# EAGLE design msc3102 (EAGLE 6.6.0)

## Sheet 1 of 3
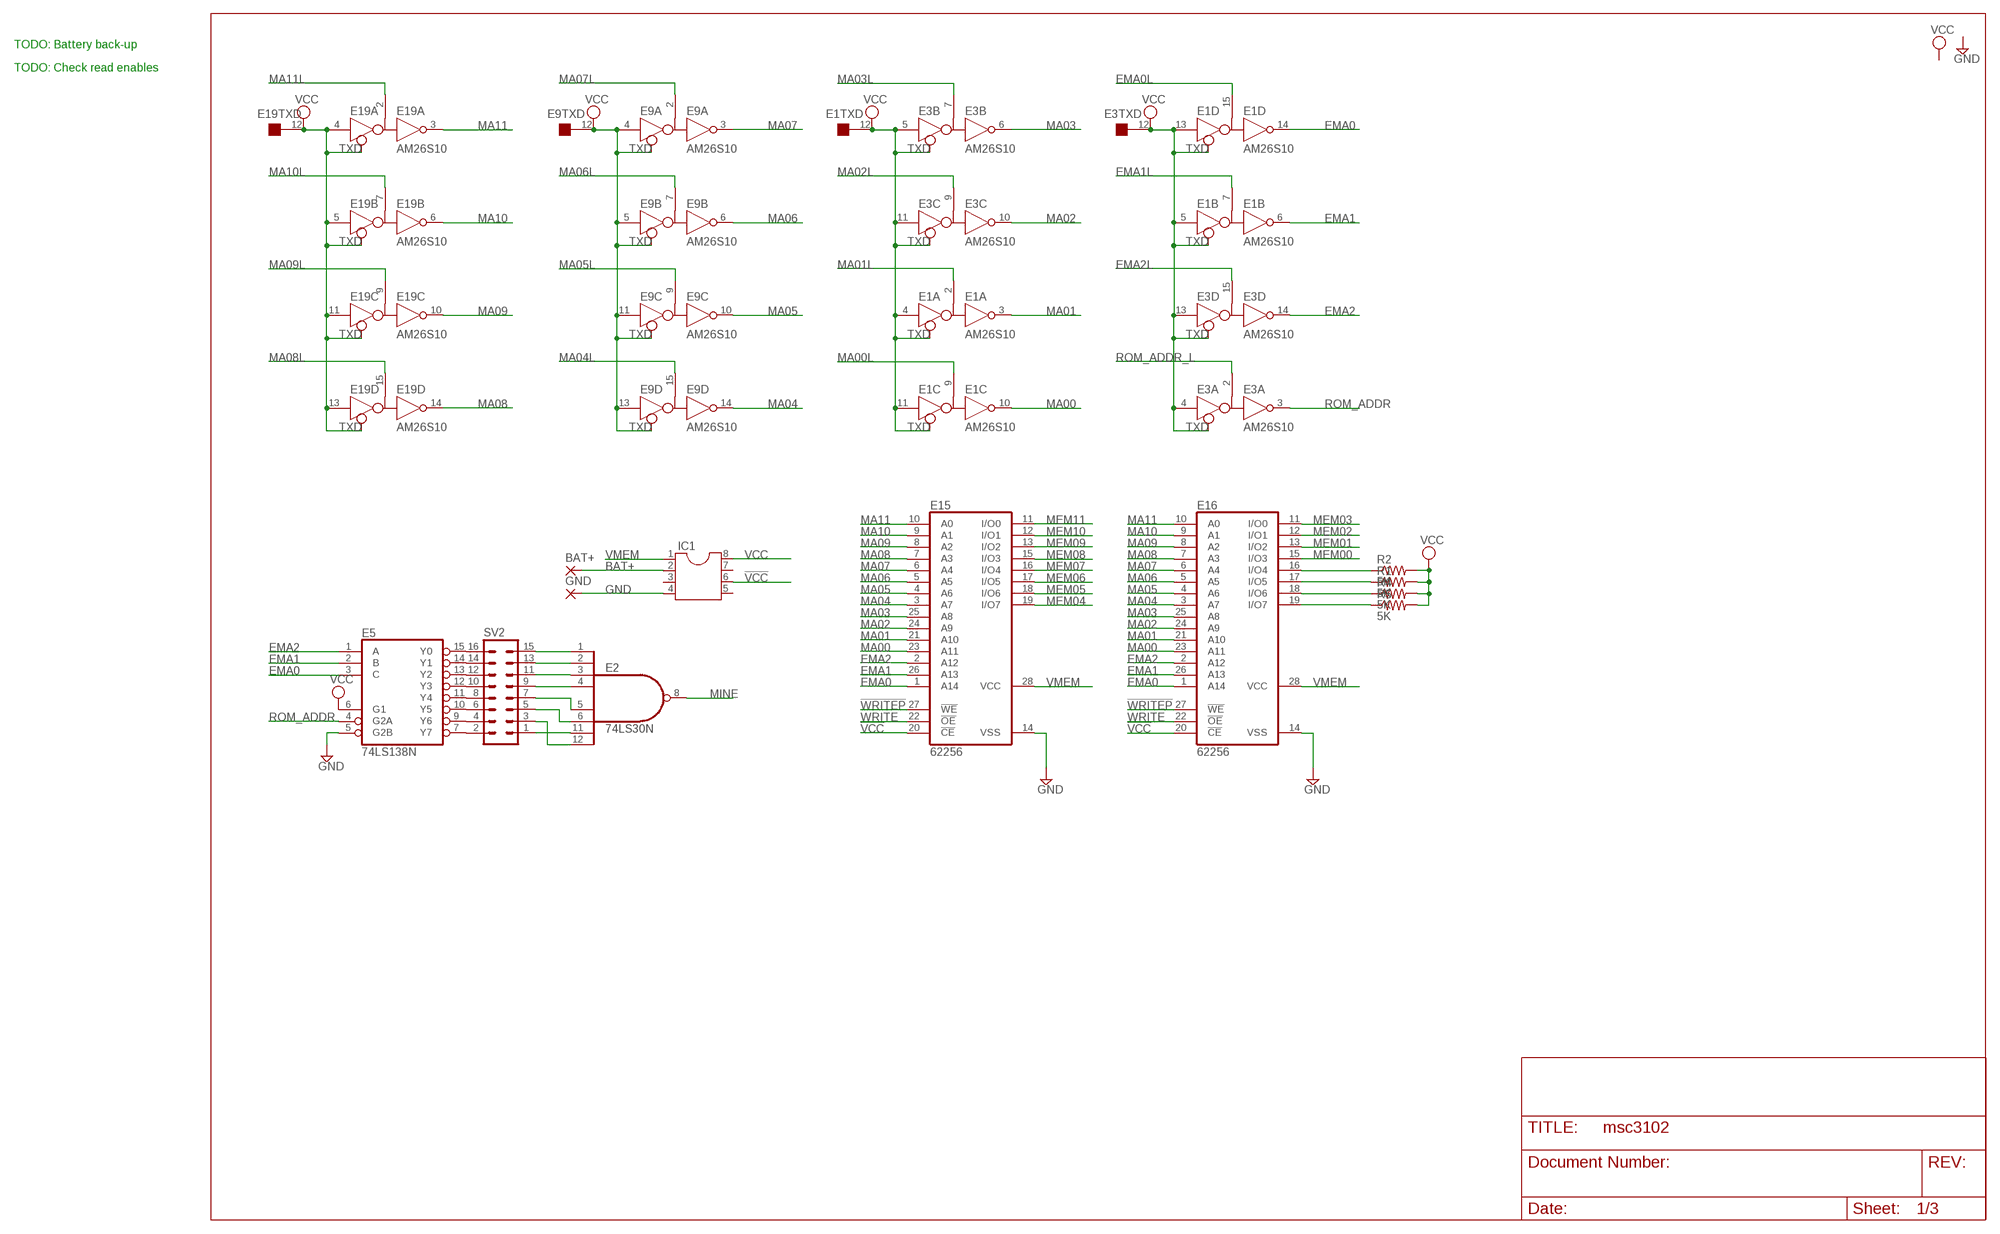
[diagram p0: schematic, sheet 1]

### Parts
BAT+  2,15/1,0  [2,15/1,0]
E1  AM26S10  [DIL16]
E2  74LS30N  [DIL14]
E3  AM26S10  [DIL16]
E5  74LS138N  [DIL16]
E9  AM26S10  [DIL16]
E15  62256  58C256P  [DIL28-6]
E16  62256  58C256P  [DIL28-6]
E19  AM26S10  [DIL16]
GND  2,15/1,0  [2,15/1,0]
IC1  DIL8  [DIL08]
R1  5K  R-US_0207/10  [0207/10]
R2  5K  R-US_0207/10  [0207/10]
R4  5K  R-US_0207/10  [0207/10]
R5  5K  R-US_0207/10  [0207/10]
SV2  MA08-2  [MA08-2]

### Nets
!VCC: E15.20(!CE) E16.20(!CE) IC1.6
!WRITEP: E15.27(!WE) E16.27(!WE) ; also sheet 2
BAT+: BAT+.1(P) IC1.2
EMA0: E1.14(D:R) E5.3(C) E15.1(A14) E16.1(A14)
EMA0L: E1.15(D:B) ; also sheet 3
EMA1: E1.6(B:R) E5.2(B) E15.26(A13) E16.26(A13)
EMA1L: E1.7(B:B) ; also sheet 3
EMA2: E3.14(D:R) E5.1(A) E15.2(A12) E16.2(A12)
EMA2L: E3.15(D:B) ; also sheet 3
GND [supply]: E5.5(G2B) E15.14(VSS) E16.14(VSS) GND.1(P) IC1.4 ; also sheet 2,3
MA00: E1.10(C:R) E15.23(A11) E16.23(A11)
MA00L: E1.9(C:B) ; also sheet 3
MA01: E1.3(A:R) E15.21(A10) E16.21(A10)
MA01L: E1.2(A:B) ; also sheet 3
MA02: E3.10(C:R) E15.24(A9) E16.24(A9)
MA02L: E3.9(C:B) ; also sheet 3
MA03: E3.6(B:R) E15.25(A8) E16.25(A8)
MA03L: E3.7(B:B) ; also sheet 3
MA04: E9.14(D:R) E15.3(A7) E16.3(A7)
MA04L: E9.15(D:B) ; also sheet 3
MA05: E9.10(C:R) E15.4(A6) E16.4(A6)
MA05L: E9.9(C:B) ; also sheet 3
MA06: E9.6(B:R) E15.5(A5) E16.5(A5)
MA06L: E9.7(B:B) ; also sheet 3
MA07: E9.3(A:R) E15.6(A4) E16.6(A4)
MA07L: E9.2(A:B) ; also sheet 3
MA08: E15.7(A3) E16.7(A3) E19.14(D:R)
MA08L: E19.15(D:B) ; also sheet 3
MA09: E15.8(A2) E16.8(A2) E19.10(C:R)
MA09L: E19.9(C:B) ; also sheet 3
MA10: E15.9(A1) E16.9(A1) E19.6(B:R)
MA10L: E19.7(B:B) ; also sheet 3
MA11: E15.10(A0) E16.10(A0) E19.3(A:R)
MA11L: E19.2(A:B) ; also sheet 3
MEM00: E16.15(I/O3) ; also sheet 2
MEM01: E16.13(I/O2) ; also sheet 2
MEM02: E16.12(I/O1) ; also sheet 2
MEM03: E16.11(I/O0) ; also sheet 2
MEM04: E15.19(I/O7) ; also sheet 2
MEM05: E15.18(I/O6) ; also sheet 2
MEM06: E15.17(I/O5) ; also sheet 2
MEM07: E15.16(I/O4) ; also sheet 2
MEM08: E15.15(I/O3) ; also sheet 2
MEM09: E15.13(I/O2) ; also sheet 2
MEM10: E15.12(I/O1) ; also sheet 2
MEM11: E15.11(I/O0) ; also sheet 2
MINE: E2.8(O) ; also sheet 2
N$1: E5.7(Y7) SV2.2
N$18: E5.9(Y6) SV2.4
N$19: E5.10(Y5) SV2.6
N$20: E5.11(Y4) SV2.8
N$21: E5.12(Y3) SV2.10
N$22: E5.13(Y2) SV2.12
N$23: E5.14(Y1) SV2.14
N$24: E5.15(Y0) SV2.16
N$26: E2.4(I3) SV2.9
N$27: E2.3(I2) SV2.11
N$28: E2.2(I1) SV2.13
N$29: E2.1(I0) SV2.15
N$30: E2.5(I4) SV2.7
N$31: E2.11(I6) SV2.1
N$32: E2.12(I7) SV2.3
N$33: E2.6(I5) SV2.5
N$35: E16.18(I/O6) R4.1
N$38: E16.16(I/O4) R2.1
N$44: E16.17(I/O5) R1.1
N$45: E16.19(I/O7) R5.1
ROM_ADDR: E3.3(A:R) E5.4(G2A)
ROM_ADDR_L: E3.2(A:B) ; also sheet 3
VCC [supply]: E1.4(A:D) E1.5(B:D) E1.11(C:D) E1.12(TXD:TXD) E1.13(D:D) E3.4(A:D) E3.5(B:D) E3.11(C:D) E3.12(TXD:TXD) E3.13(D:D) E5.6(G1) E9.4(A:D) E9.5(B:D) E9.11(C:D) E9.12(TXD:TXD) E9.13(D:D) E19.4(A:D) E19.5(B:D) E19.11(C:D) E19.12(TXD:TXD) E19.13(D:D) IC1.8 R1.2 R2.2 R4.2 R5.2 ; also sheet 2,3
VMEM: E15.28(VCC) E16.28(VCC) IC1.1
WRITE: E15.22(!OE) E16.22(!OE) ; also sheet 2,3
Unconnected: IC1.3 IC1.5 IC1.7

### Notes on the sheet
- TODO: Battery back-up
- TODO: Check read enables

## Sheet 2 of 3
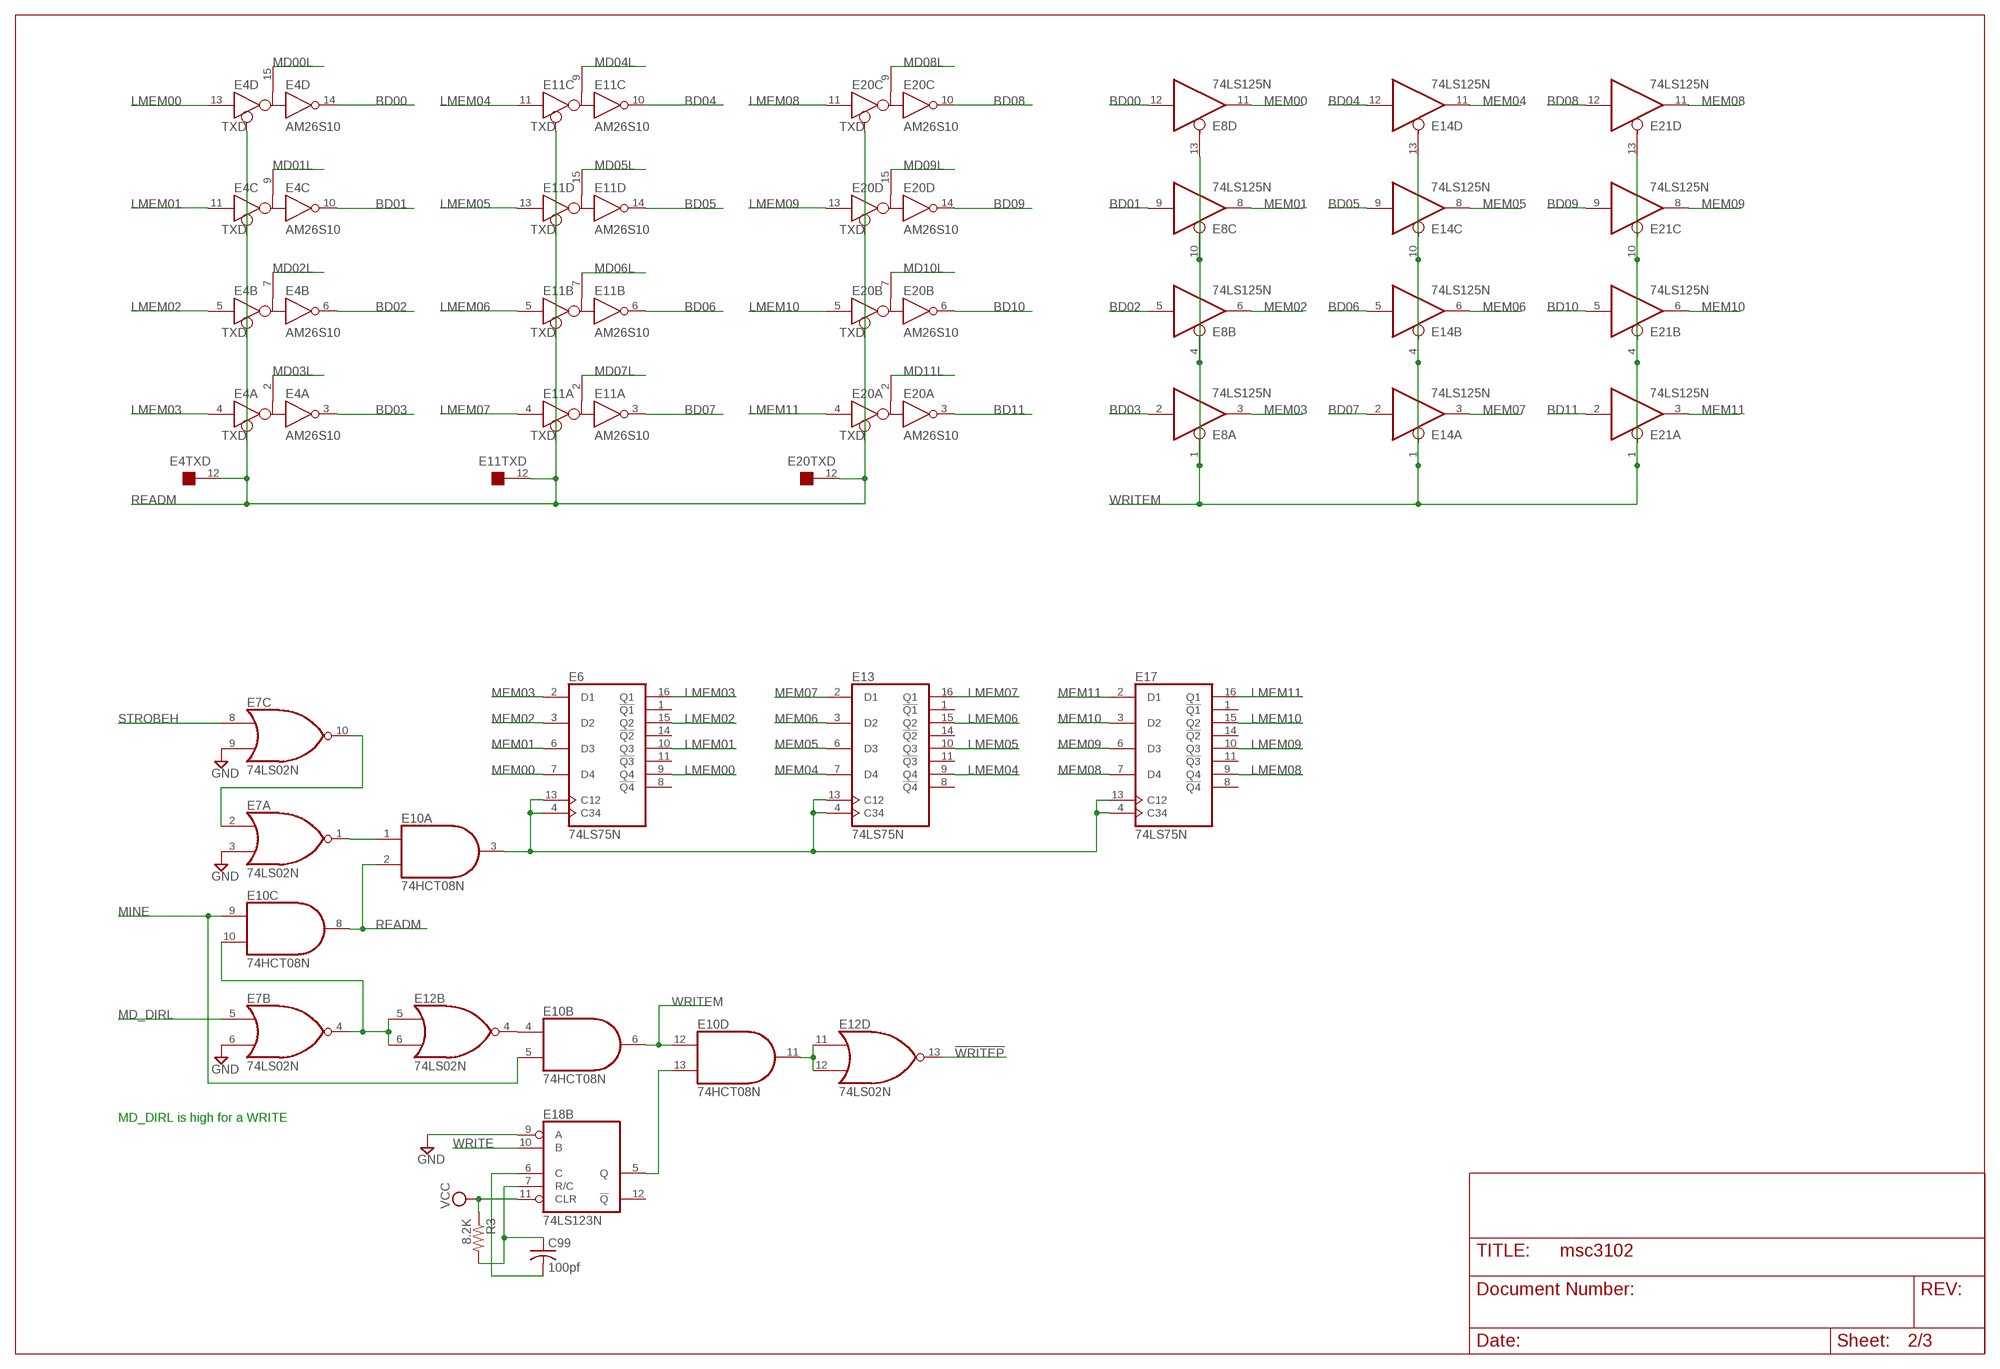
[diagram p1: schematic, sheet 2]

### Parts
C99  100pf  C-US050-025X075  [C050-025X075]
E4  AM26S10  [DIL16]
E6  74LS75N  [DIL16]
E7  74LS02N  [DIL14]
E8  74LS125N  [DIL14]
E10  74HCT08N  74LS08N  [DIL14]
E11  AM26S10  [DIL16]
E12  74LS02N  [DIL14]
E13  74LS75N  [DIL16]
E14  74LS125N  [DIL14]
E17  74LS75N  [DIL16]
E18  74LS123N  [DIL16]
E20  AM26S10  [DIL16]
E21  74LS125N  [DIL14]
R3  8.2K  R-US_0207/10  [0207/10]

### Nets
!WRITEP: E12.13(D:O) ; also sheet 1
BD00: E4.14(D:R) E8.12(D:I)
BD01: E4.10(C:R) E8.9(C:I)
BD02: E4.6(B:R) E8.5(B:I)
BD03: E4.3(A:R) E8.2(A:I)
BD04: E11.10(C:R) E14.12(D:I)
BD05: E11.14(D:R) E14.9(C:I)
BD06: E11.6(B:R) E14.5(B:I)
BD07: E11.3(A:R) E14.2(A:I)
BD08: E20.10(C:R) E21.12(D:I)
BD09: E20.14(D:R) E21.9(C:I)
BD10: E20.6(B:R) E21.5(B:I)
BD11: E20.3(A:R) E21.2(A:I)
GND [supply]: E7.3(A:I1) E7.6(B:I1) E7.9(C:I1) E18.9(B:A) ; also sheet 1,3
LMEM00: E4.13(D:D) E6.9(Q4)
LMEM01: E4.11(C:D) E6.10(Q3)
LMEM02: E4.5(B:D) E6.15(Q2)
LMEM03: E4.4(A:D) E6.16(Q1)
LMEM04: E11.11(C:D) E13.9(Q4)
LMEM05: E11.13(D:D) E13.10(Q3)
LMEM06: E11.5(B:D) E13.15(Q2)
LMEM07: E11.4(A:D) E13.16(Q1)
LMEM08: E17.9(Q4) E20.11(C:D)
LMEM09: E17.10(Q3) E20.13(D:D)
LMEM10: E17.15(Q2) E20.5(B:D)
LMEM11: E17.16(Q1) E20.4(A:D)
MD00L: E4.15(D:B) ; also sheet 3
MD01L: E4.9(C:B) ; also sheet 3
MD02L: E4.7(B:B) ; also sheet 3
MD03L: E4.2(A:B) ; also sheet 3
MD04L: E11.9(C:B) ; also sheet 3
MD05L: E11.15(D:B) ; also sheet 3
MD06L: E11.7(B:B) ; also sheet 3
MD07L: E11.2(A:B) ; also sheet 3
MD08L: E20.9(C:B) ; also sheet 3
MD09L: E20.15(D:B) ; also sheet 3
MD10L: E20.7(B:B) ; also sheet 3
MD11L: E20.2(A:B) ; also sheet 3
MD_DIRL: E7.5(B:I0) ; also sheet 3
MEM00: E6.7(D4) E8.11(D:O) ; also sheet 1
MEM01: E6.6(D3) E8.8(C:O) ; also sheet 1
MEM02: E6.3(D2) E8.6(B:O) ; also sheet 1
MEM03: E6.2(D1) E8.3(A:O) ; also sheet 1
MEM04: E13.7(D4) E14.11(D:O) ; also sheet 1
MEM05: E13.6(D3) E14.8(C:O) ; also sheet 1
MEM06: E13.3(D2) E14.6(B:O) ; also sheet 1
MEM07: E13.2(D1) E14.3(A:O) ; also sheet 1
MEM08: E17.7(D4) E21.11(D:O) ; also sheet 1
MEM09: E17.6(D3) E21.8(C:O) ; also sheet 1
MEM10: E17.3(D2) E21.6(B:O) ; also sheet 1
MEM11: E17.2(D1) E21.3(A:O) ; also sheet 1
MINE: E10.5(B:I1) E10.9(C:I0) ; also sheet 1
N$25: C99.1 E18.7(B:R/C) R3.2
N$34: C99.2 E18.6(B:C)
N$36: E10.4(B:I0) E12.4(B:O)
N$37: E7.4(B:O) E10.10(C:I1) E12.5(B:I0) E12.6(B:I1)
N$39: E7.1(A:O) E10.1(A:I0)
N$40: E7.2(A:I0) E7.10(C:O)
N$41: E6.4(C34) E6.13(C12) E10.3(A:O) E13.4(C34) E13.13(C12) E17.4(C34) E17.13(C12)
N$42: E10.13(D:I1) E18.5(B:Q)
N$43: E10.11(D:O) E12.11(D:I0) E12.12(D:I1)
READM: E4.12(TXD:TXD) E10.2(A:I1) E10.8(C:O) E11.12(TXD:TXD) E20.12(TXD:TXD)
STROBEH: E7.8(C:I0) ; also sheet 3
VCC [supply]: E18.11(B:CLR) R3.1 ; also sheet 1,3
WRITE: E18.10(B:B) ; also sheet 1,3
WRITEM: E8.1(A:OE) E8.4(B:OE) E8.10(C:OE) E8.13(D:OE) E10.6(B:O) E10.12(D:I0) E14.1(A:OE) E14.4(B:OE) E14.10(C:OE) E14.13(D:OE) E21.1(A:OE) E21.4(B:OE) E21.10(C:OE) E21.13(D:OE)
Unconnected: E6.1(!Q1) E6.8(!Q4) E6.11(!Q3) E6.14(!Q2) E7.11(D:I0) E7.12(D:I1) E7.13(D:O) E12.1(A:O) E12.2(A:I0) E12.3(A:I1) E12.8(C:I0) E12.9(C:I1) E12.10(C:O) E13.1(!Q1) E13.8(!Q4) E13.11(!Q3) E13.14(!Q2) E17.1(!Q1) E17.8(!Q4) E17.11(!Q3) E17.14(!Q2) E18.1(A:A) E18.2(A:B) E18.3(A:CLR) E18.4(A:!Q) E18.12(B:!Q) E18.13(A:Q) E18.14(A:C) E18.15(A:R/C)

### Notes on the sheet
- MD_DIRL is high for a WRITE

## Sheet 3 of 3
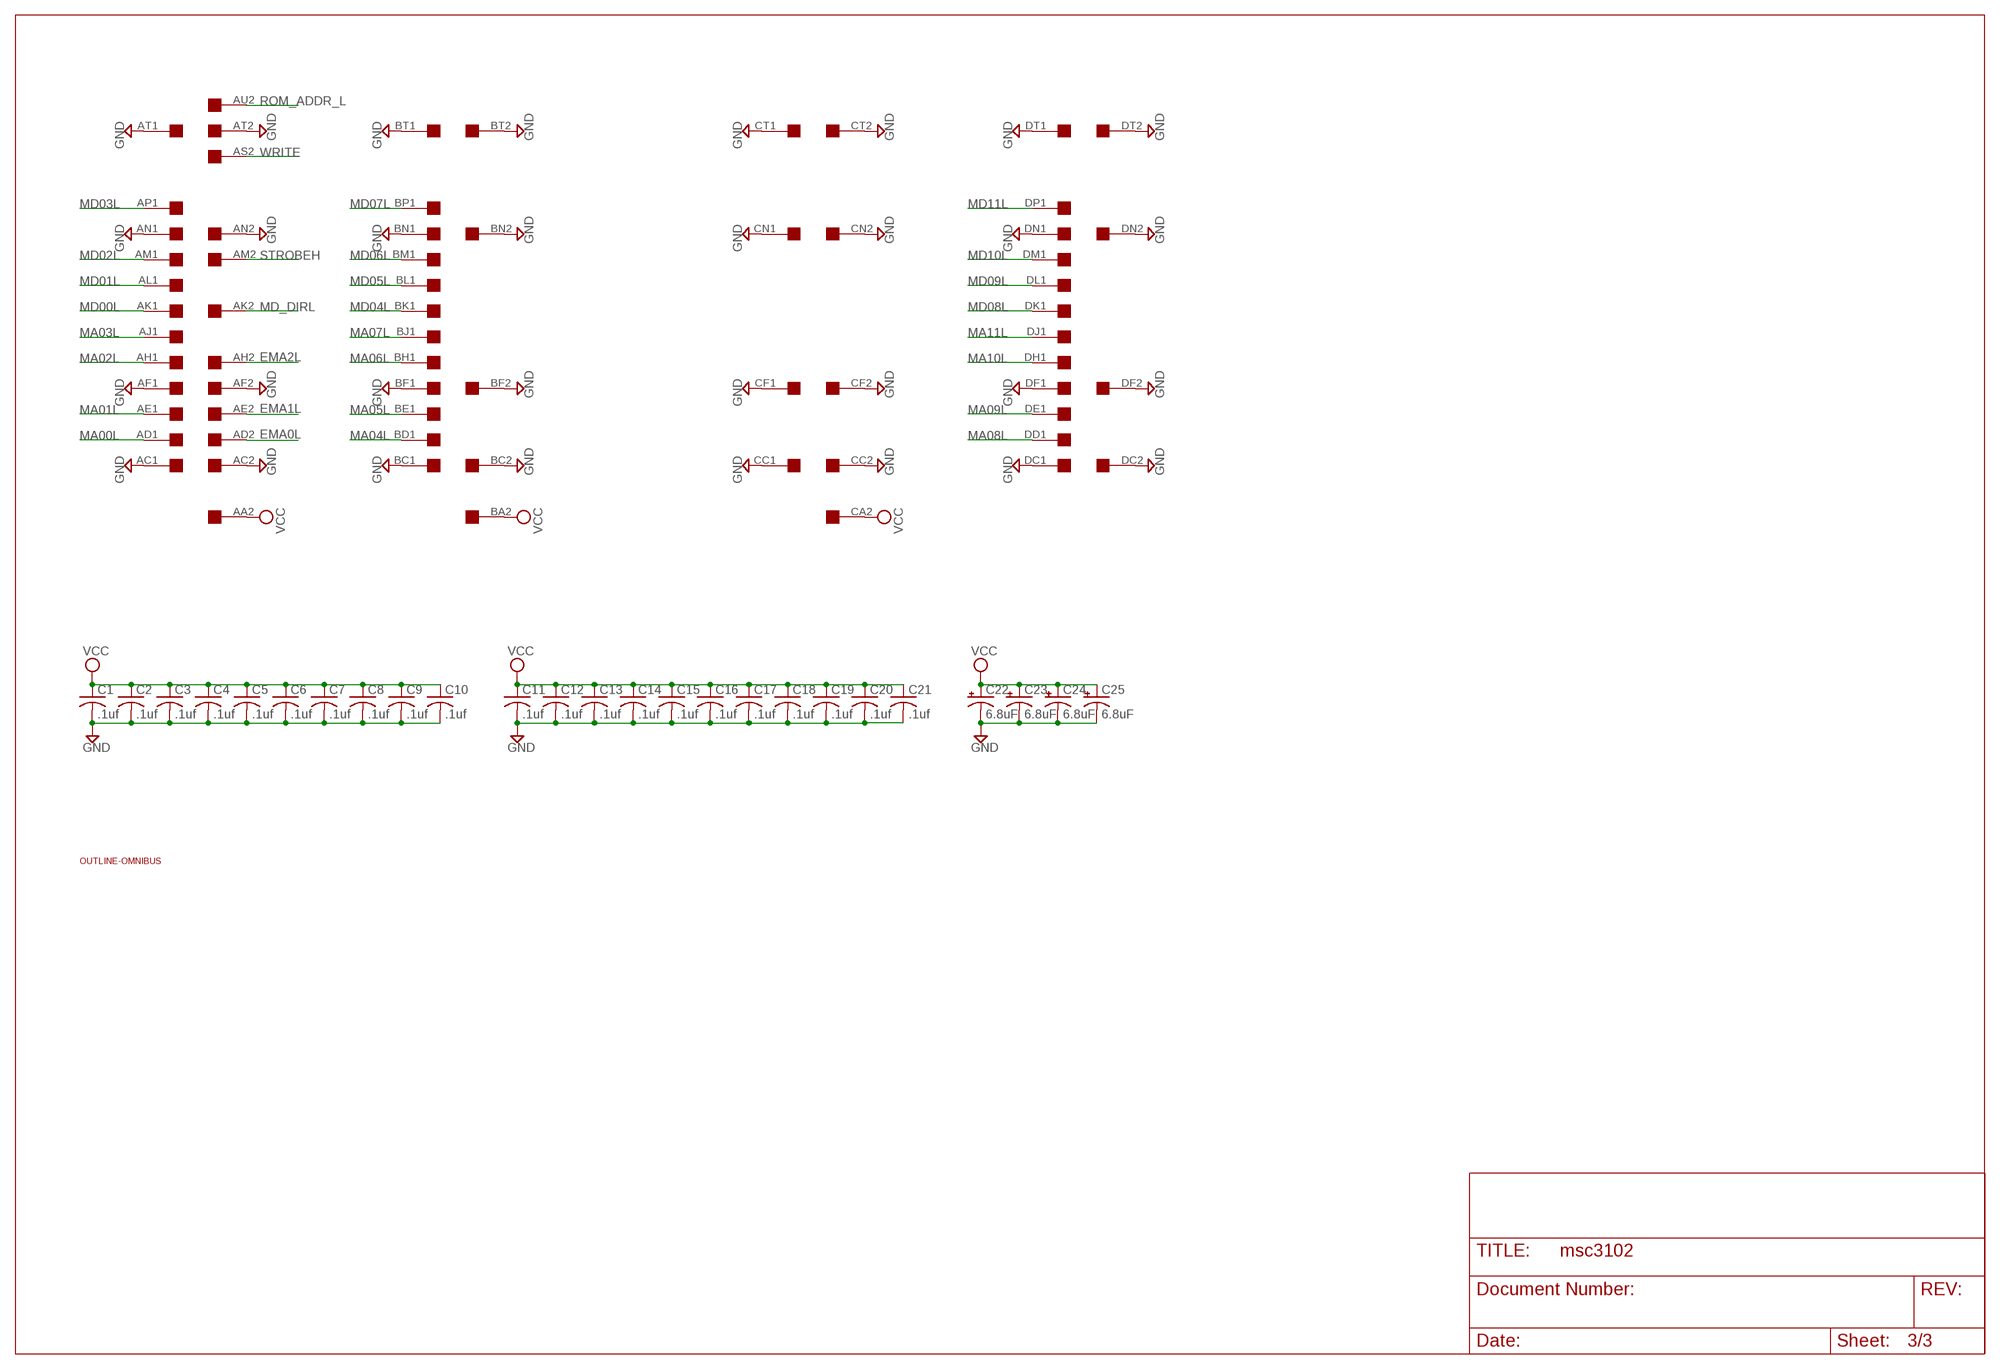
[diagram p2: schematic, sheet 3]

### Parts
C1  .1uf  C-US050-025X075  [C050-025X075]
C2  .1uf  C-US050-025X075  [C050-025X075]
C3  .1uf  C-US050-025X075  [C050-025X075]
C4  .1uf  C-US050-025X075  [C050-025X075]
C5  .1uf  C-US050-025X075  [C050-025X075]
C6  .1uf  C-US050-025X075  [C050-025X075]
C7  .1uf  C-US050-025X075  [C050-025X075]
C8  .1uf  C-US050-025X075  [C050-025X075]
C9  .1uf  C-US050-025X075  [C050-025X075]
C10  .1uf  C-US050-025X075  [C050-025X075]
C11  .1uf  C-US050-025X075  [C050-025X075]
C12  .1uf  C-US050-025X075  [C050-025X075]
C13  .1uf  C-US050-025X075  [C050-025X075]
C14  .1uf  C-US050-025X075  [C050-025X075]
C15  .1uf  C-US050-025X075  [C050-025X075]
C16  .1uf  C-US050-025X075  [C050-025X075]
C17  .1uf  C-US050-025X075  [C050-025X075]
C18  .1uf  C-US050-025X075  [C050-025X075]
C19  .1uf  C-US050-025X075  [C050-025X075]
C20  .1uf  C-US050-025X075  [C050-025X075]
C21  .1uf  C-US050-025X075  [C050-025X075]
C22  6.8uF  CPOL-USE22-6AXIAL  [E22-6]
C23  6.8uF  CPOL-USE22-6AXIAL  [E22-6]
C24  6.8uF  CPOL-USE22-6AXIAL  [E22-6]
C25  6.8uF  CPOL-USE22-6AXIAL  [E22-6]
U$1  OUTLINE-OMNIBUS  [OMNIBUS]
U$2  QUAD  [EDGE-CON8]

### Nets
EMA0L: U$2.AD2 ; also sheet 1
EMA1L: U$2.AE2 ; also sheet 1
EMA2L: U$2.AH2 ; also sheet 1
GND [supply]: C1.2 C2.2 C3.2 C4.2 C5.2 C6.2 C7.2 C8.2 C9.2 C10.2 C11.2 C12.2 C13.2 C14.2 C15.2 C16.2 C17.2 C18.2 C19.2 C20.2 C21.2 C22.- C23.- C24.- C25.- U$2.AC1 U$2.AC2 U$2.AF1 U$2.AF2 U$2.AN1 U$2.AN2 U$2.AT1 U$2.AT2 U$2.BC1 U$2.BC2 U$2.BF1 U$2.BF2 U$2.BN1 U$2.BN2 U$2.BT1 U$2.BT2 U$2.CC1 U$2.CC2 U$2.CF1 U$2.CF2 U$2.CN1 U$2.CN2 U$2.CT1 U$2.CT2 U$2.DC1 U$2.DC2 U$2.DF1 U$2.DF2 U$2.DN1 U$2.DN2 U$2.DT1 U$2.DT2 ; also sheet 1,2
MA00L: U$2.AD1 ; also sheet 1
MA01L: U$2.AE1 ; also sheet 1
MA02L: U$2.AH1 ; also sheet 1
MA03L: U$2.AJ1 ; also sheet 1
MA04L: U$2.BD1 ; also sheet 1
MA05L: U$2.BE1 ; also sheet 1
MA06L: U$2.BH1 ; also sheet 1
MA07L: U$2.BJ1 ; also sheet 1
MA08L: U$2.DD1 ; also sheet 1
MA09L: U$2.DE1 ; also sheet 1
MA10L: U$2.DH1 ; also sheet 1
MA11L: U$2.DJ1 ; also sheet 1
MD00L: U$2.AK1 ; also sheet 2
MD01L: U$2.AL1 ; also sheet 2
MD02L: U$2.AM1 ; also sheet 2
MD03L: U$2.AP1 ; also sheet 2
MD04L: U$2.BK1 ; also sheet 2
MD05L: U$2.BL1 ; also sheet 2
MD06L: U$2.BM1 ; also sheet 2
MD07L: U$2.BP1 ; also sheet 2
MD08L: U$2.DK1 ; also sheet 2
MD09L: U$2.DL1 ; also sheet 2
MD10L: U$2.DM1 ; also sheet 2
MD11L: U$2.DP1 ; also sheet 2
MD_DIRL: U$2.AK2 ; also sheet 2
ROM_ADDR_L: U$2.AU2 ; also sheet 1
STROBEH: U$2.AM2 ; also sheet 2
VCC [supply]: C1.1 C2.1 C3.1 C4.1 C5.1 C6.1 C7.1 C8.1 C9.1 C10.1 C11.1 C12.1 C13.1 C14.1 C15.1 C16.1 C17.1 C18.1 C19.1 C20.1 C21.1 C22.+ C23.+ C24.+ C25.+ U$2.AA2 U$2.BA2 U$2.CA2 ; also sheet 1,2
WRITE: U$2.AS2 ; also sheet 1,2
Unconnected: U$2.AA1 U$2.AB1 U$2.AB2 U$2.AJ2 U$2.AL2 U$2.AP2 U$2.AR1 U$2.AR2 U$2.AS1 U$2.AU1 U$2.AV1 U$2.AV2 U$2.BA1 U$2.BB1 U$2.BB2 U$2.BD2 U$2.BE2 U$2.BH2 U$2.BJ2 U$2.BK2 U$2.BL2 U$2.BM2 U$2.BP2 U$2.BR1 U$2.BR2 U$2.BS1 U$2.BS2 U$2.BU1 U$2.BU2 U$2.BV1 U$2.BV2 U$2.CA1 U$2.CB1 U$2.CB2 U$2.CD1 U$2.CD2 U$2.CE1 U$2.CE2 U$2.CH1 U$2.CH2 U$2.CJ1 U$2.CJ2 U$2.CK1 U$2.CK2 U$2.CL1 U$2.CL2 U$2.CM1 U$2.CM2 U$2.CP1 U$2.CP2 U$2.CR1 U$2.CR2 U$2.CS1 U$2.CS2 U$2.CU1 U$2.CU2 U$2.CV1 U$2.CV2 U$2.DA1 U$2.DA2 U$2.DB1 U$2.DB2 U$2.DD2 U$2.DE2 U$2.DH2 U$2.DJ2 U$2.DK2 U$2.DL2 U$2.DM2 U$2.DP2 U$2.DR1 U$2.DR2 U$2.DS1 U$2.DS2 U$2.DU1 U$2.DU2 U$2.DV1 U$2.DV2

## Power pins joined to a net without a drawn wire
GND: E1.1(GND:GND) E1.8(PWR:GND) E2.7(GND) E3.1(GND:GND) E3.8(PWR:GND) E4.1(GND:GND) E4.8(PWR:GND) E5.8(GND) E6.12(GND) E7.7(P:GND) E8.7(P:GND) E9.1(GND:GND) E9.8(PWR:GND) E10.7(P:GND) E11.1(GND:GND) E11.8(PWR:GND) E12.7(P:GND) E13.12(GND) E14.7(P:GND) E17.12(GND) E18.8(P:GND) E19.1(GND:GND) E19.8(PWR:GND) E20.1(GND:GND) E20.8(PWR:GND) E21.7(P:GND)
VCC: E1.16(PWR:VCC) E2.14(VCC) E3.16(PWR:VCC) E4.16(PWR:VCC) E5.16(VCC) E6.5(VCC) E7.14(P:VCC) E8.14(P:VCC) E9.16(PWR:VCC) E10.14(P:VCC) E11.16(PWR:VCC) E12.14(P:VCC) E13.5(VCC) E14.14(P:VCC) E17.5(VCC) E18.16(P:VCC) E19.16(PWR:VCC) E20.16(PWR:VCC) E21.14(P:VCC)

## Library data of the parts
BAT+ GND = wirepad:2,15/1,0: THROUGH-HOLE PAD
C1-C21 C99 = rcl:C-US: CAPACITOR, American symbol
C22-C25 = rcl:CPOL-US: POLARIZED CAPACITOR, American symbol
E1 E3 E4 E9 E11 E19 E20 = dec-con:AM26S10: Bus Transceiver
E2 = 74xx-us:74*30: 8-input NAND gate
E5 = 74xx-us:74*138: 3-line to 8-line DECODER/DEMULTIPLEXER
E6 E13 E17 = 74xx-us:74*75: 4-bit bistable LATCH
E7 E12 = 74xx-us:74*02: Quad 2-input NOR gate
E8 E14 E21 = 74xx-us:74*125: Quad bus BUFFER, 3-state
E10 = 74xx-us:74*08: Quad 2-input AND gate
E15 E16 = memory-hitachi:58C256P: MEMORY; MPN: HN58C256AP85E; OC_FARNELL: 1496447; OC_NEWARK: 61M6616
E18 = 74xx-us:74*123: Retriggerable monostable MULTIVIBRATOR
IC1 = ic-package:DIL8: Dual In Line / Socket
R1-R5 = rcl:R-US_: RESISTOR, American symbol
SV2 = con-lstb:MA08-2: PIN HEADER; OC_FARNELL: unknown; OC_NEWARK: unknown
U$1 = dec-con:OUTLINE-*: Board outlines for DEC boards.
U$2 = dec-con:QUAD: Quad-Height DEC board

## Net classes
1 supply: width 0.762 mm

## Board
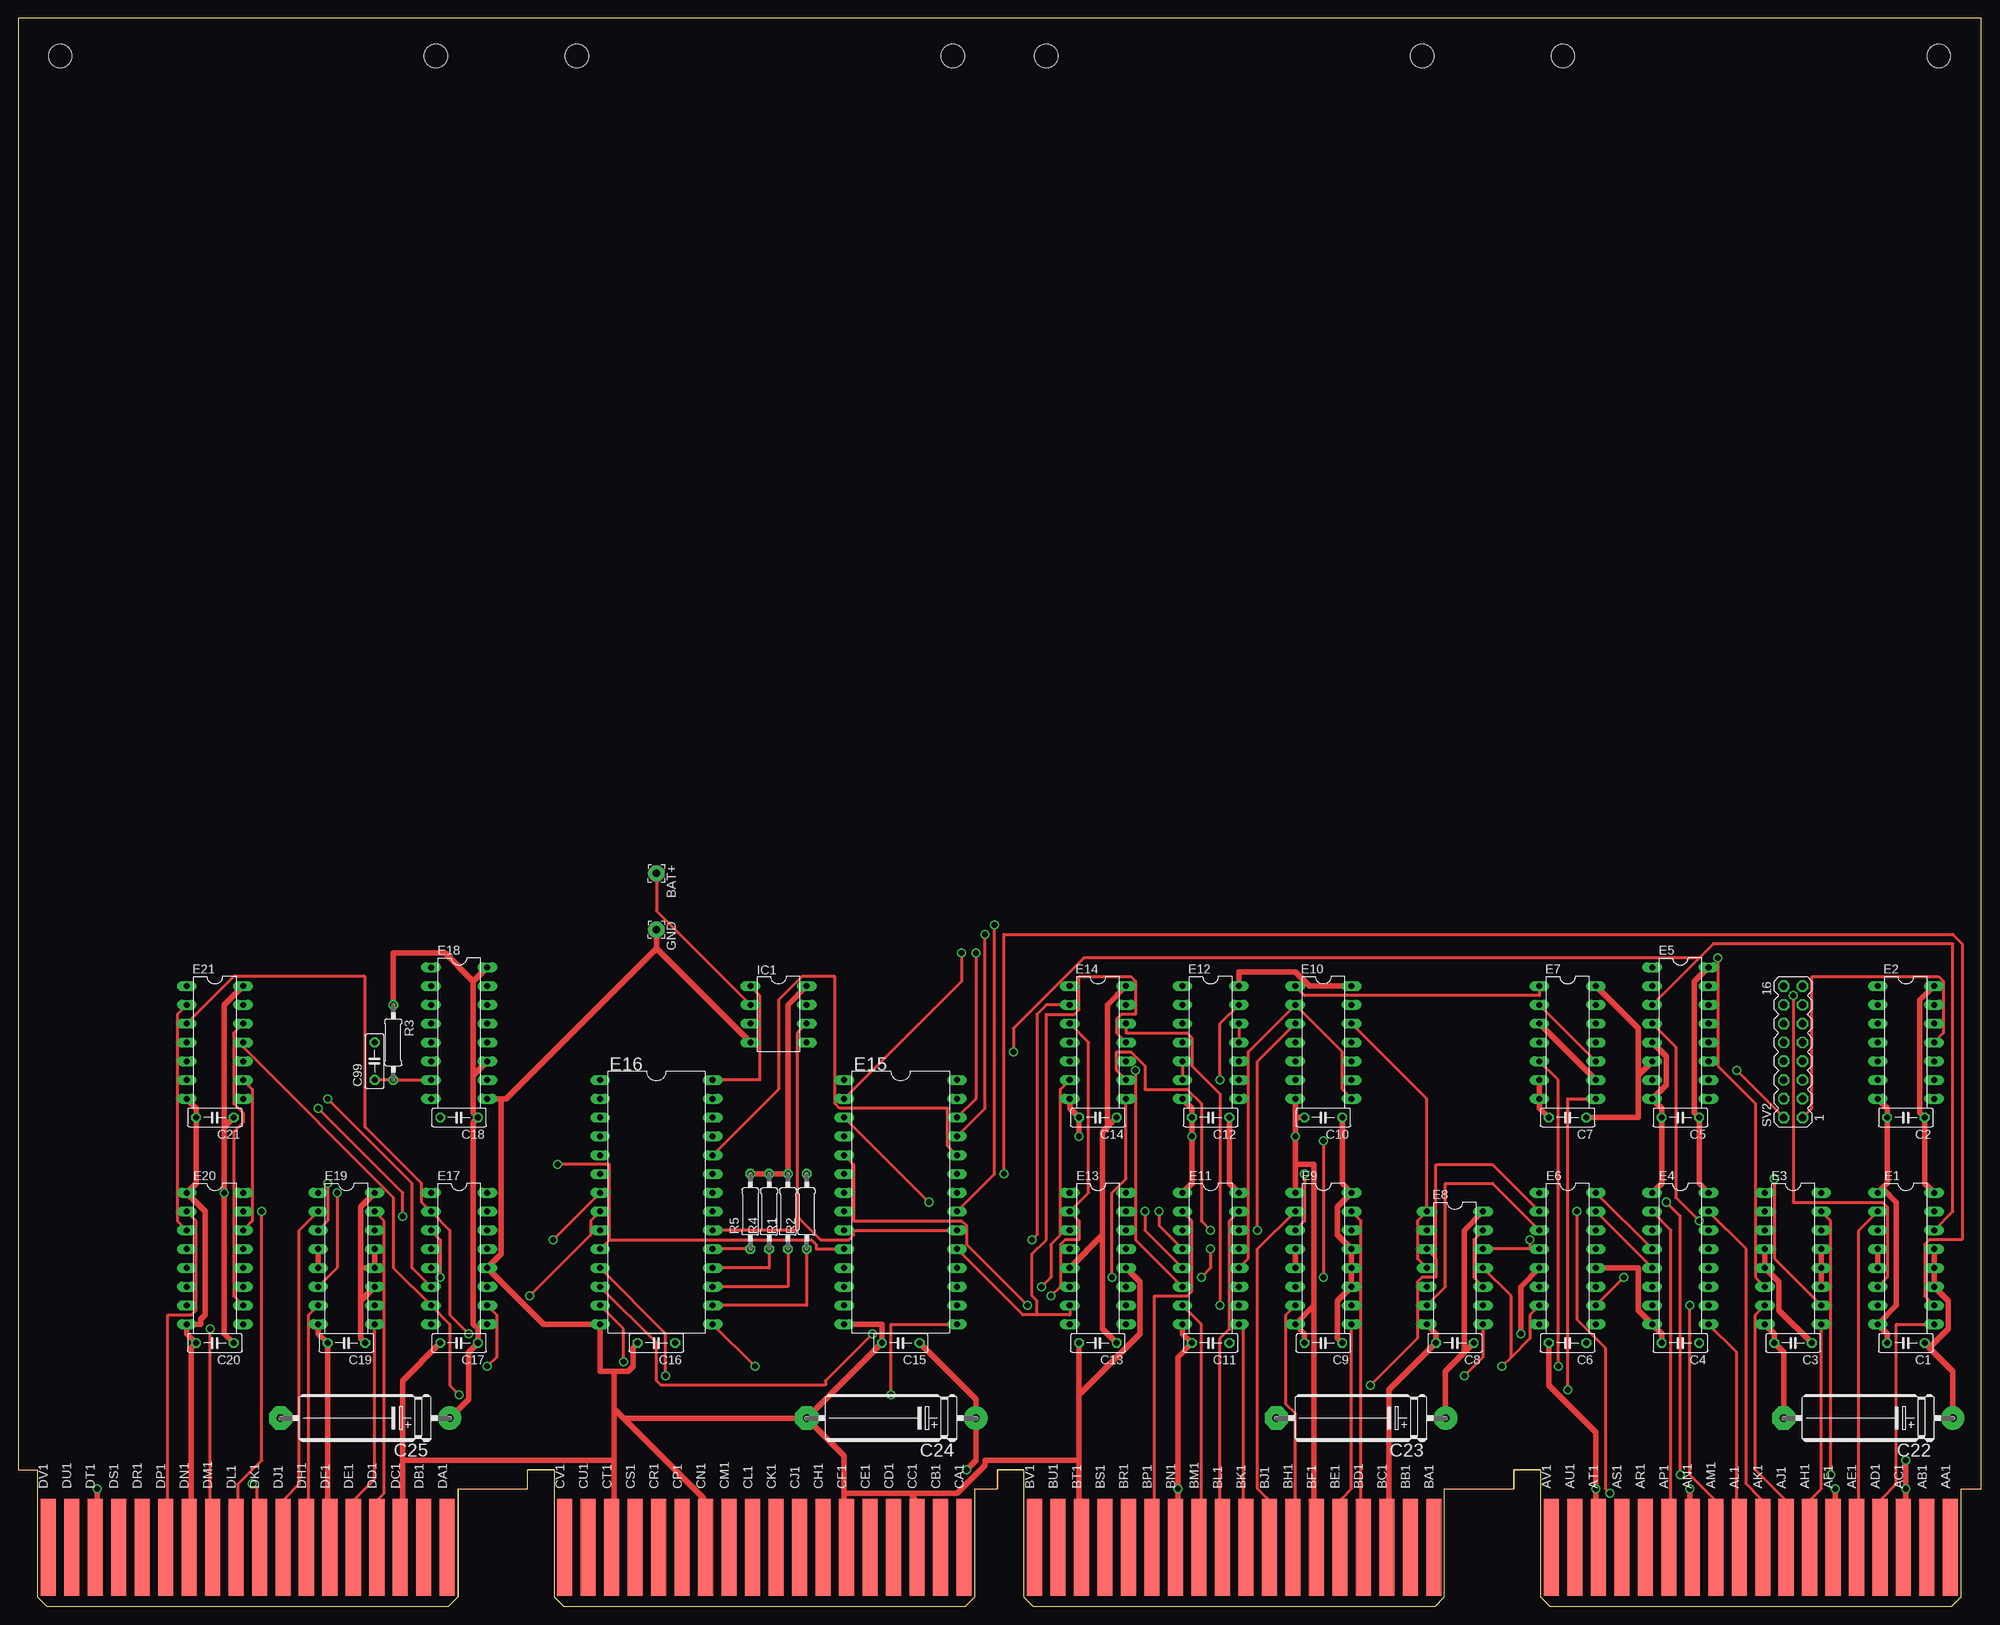
[diagram p3: board, top side]
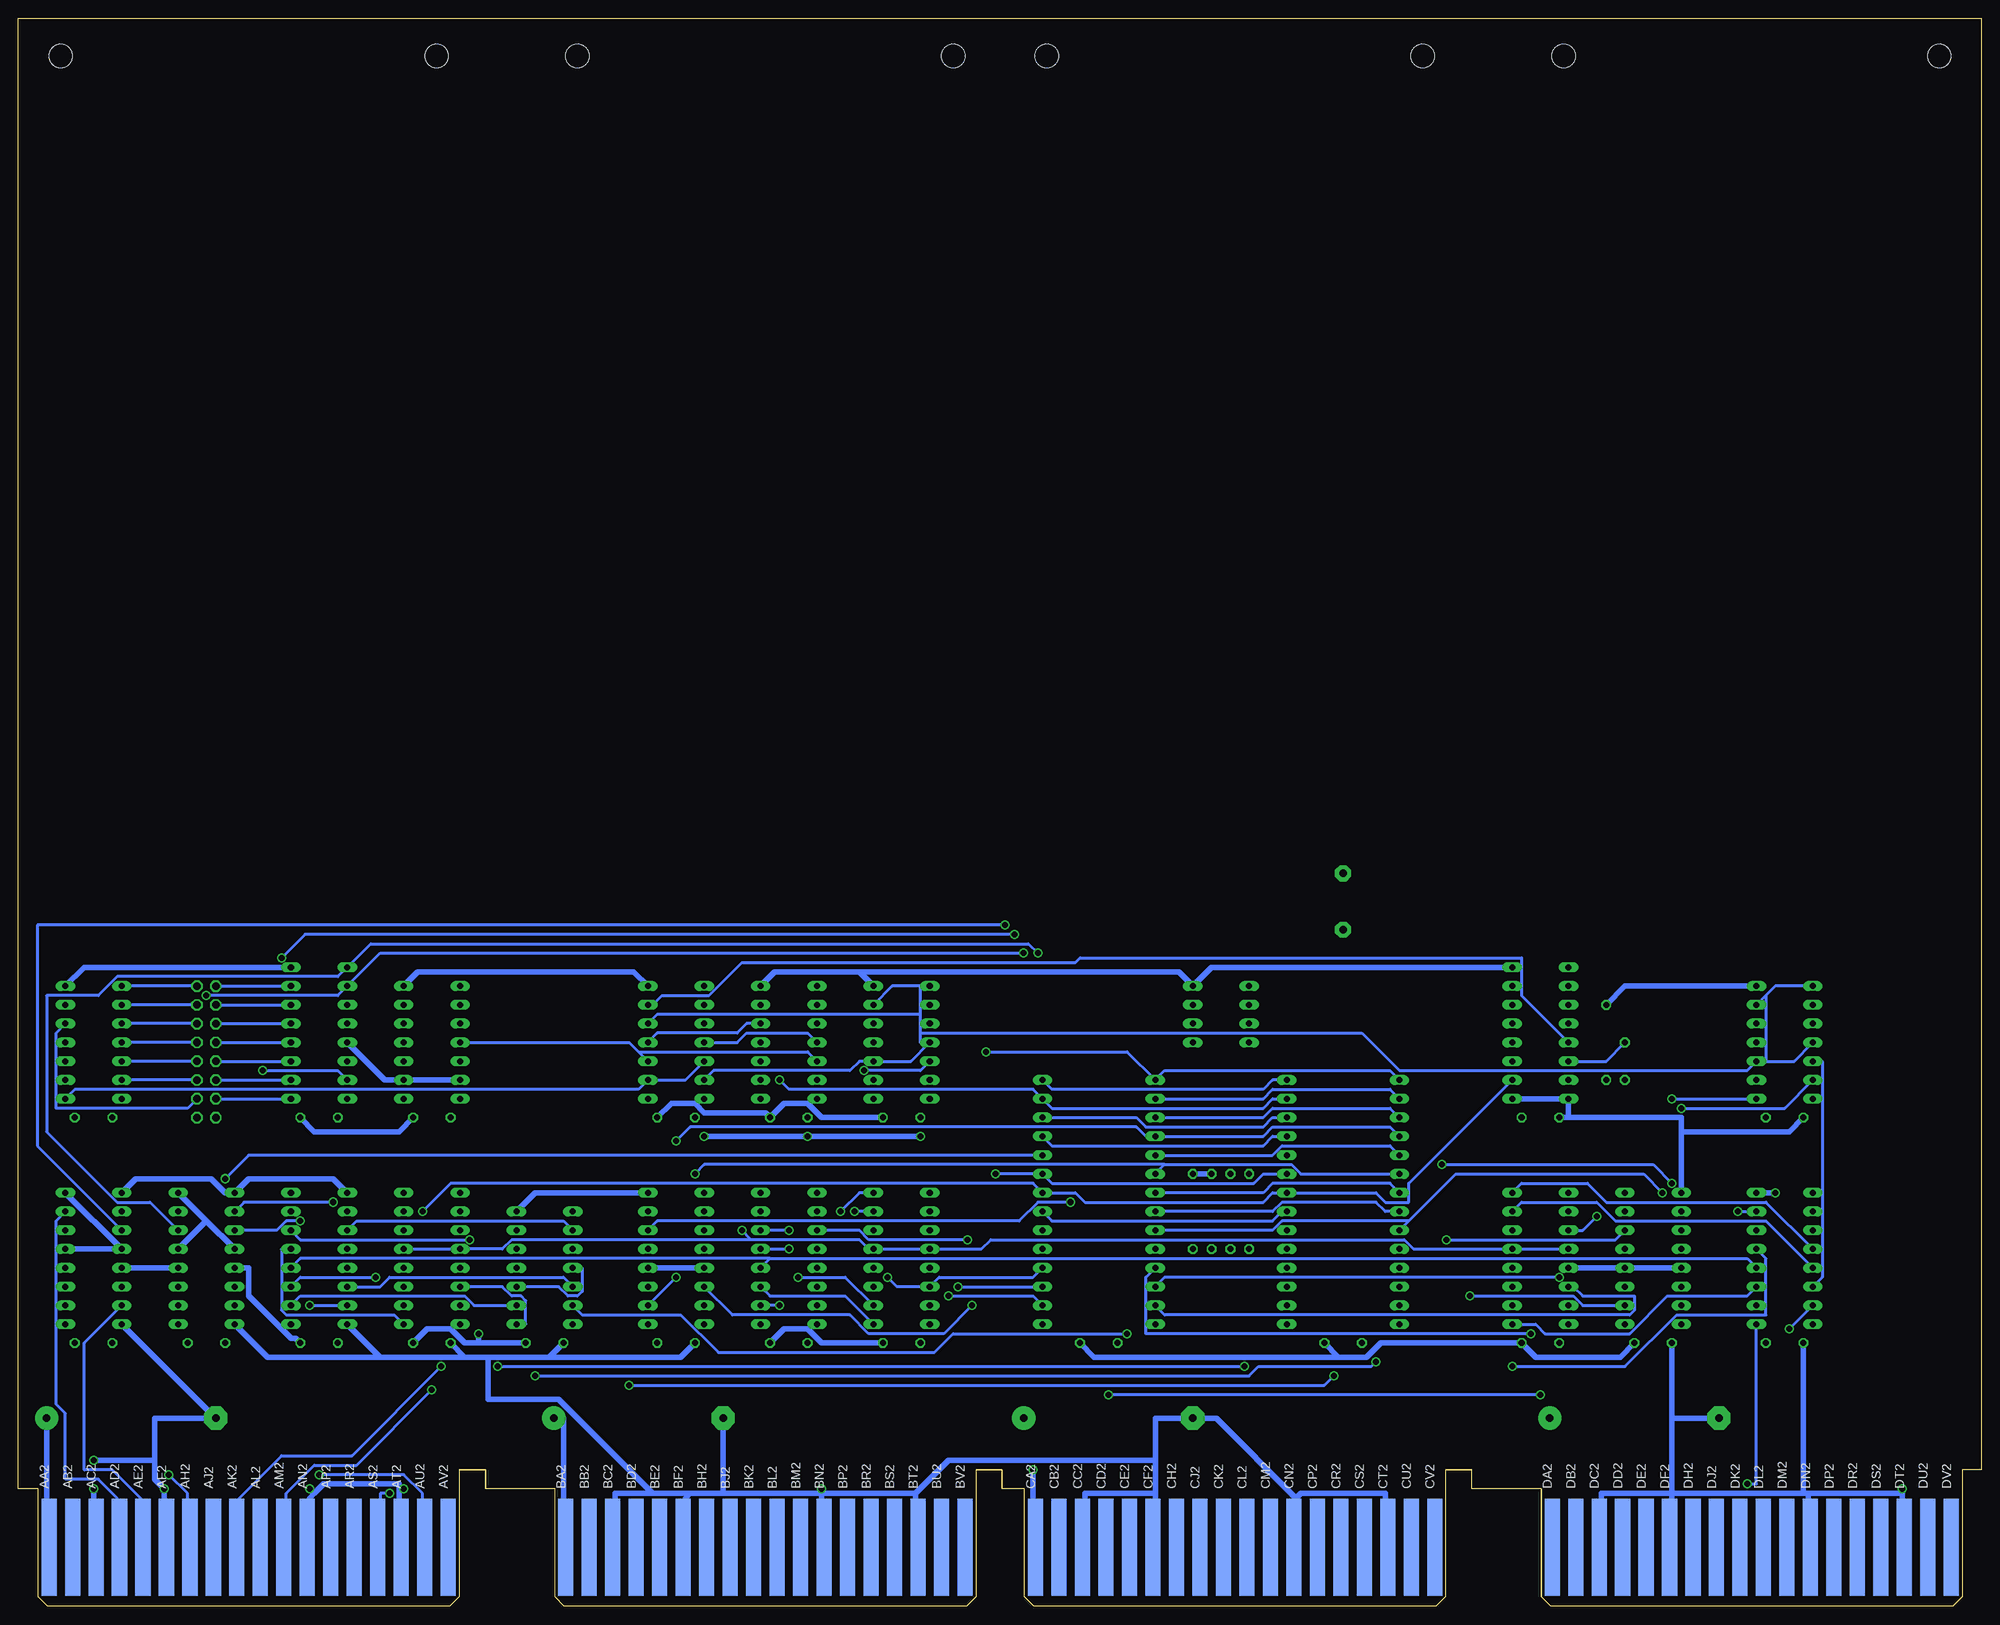
[diagram p4: board, bottom side, seen from below]

Size 265.3 x 214.63 mm. Coordinates in mm from the lower left corner, seen from the top.
Copper layers (1+16): Top 0.035mm / dielectric 1.5mm / Bottom 0.035mm
Design rules "16mils": minimum track width 16mil, minimum drill 32mil, track to track 15mil, track to pad 10mil, pad to pad 10mil, via to via 10mil, smd to smd 10mil, copper to edge 13mil, drill to drill 10mil, minimum pad ring 10mil, minimum via ring 8mil, stop-mask expansion 0mil, vias tented up to drill 0mil, thermal gap 10mil

### Footprints (pad centres in the part's own frame; a part is rotated, then mirrored left to right if it is on the bottom)
2,15/1,0 = drill 1.016 pad 2.159 octagon: 1 0,0
C050-025X075 = drill 0.813 octagon: 1 -2.54,0; 2 2.54,0
E22-6 = drill 1.016 pad 3.15: + -11.43,0 | drill 1.016 pad 3.15 octagon: - 11.43,0
DIL16 = drill 0.813 long: 1 -8.89,-3.81; 2 -6.35,-3.81; 3 -3.81,-3.81; 4 -1.27,-3.81; 5 1.27,-3.81; 6 3.81,-3.81; 7 6.35,-3.81; 8 8.89,-3.81; 9 8.89,3.81; 10 6.35,3.81; 11 3.81,3.81; 12 1.27,3.81; 13 -1.27,3.81; 14 -3.81,3.81; 15 -6.35,3.81; 16 -8.89,3.81
DIL14 = drill 0.813 long: 1 -7.62,-3.81; 2 -5.08,-3.81; 3 -2.54,-3.81; 4 0,-3.81; 5 2.54,-3.81; 6 5.08,-3.81; 7 7.62,-3.81; 8 7.62,3.81; 9 5.08,3.81; 10 2.54,3.81; 11 0,3.81; 12 -2.54,3.81; 13 -5.08,3.81; 14 -7.62,3.81
DIL28-6 = drill 0.813 long: 1 -16.51,-7.62; 2 -13.97,-7.62; 3 -11.43,-7.62; 4 -8.89,-7.62; 5 -6.35,-7.62; 6 -3.81,-7.62; 7 -1.27,-7.62; 8 1.27,-7.62; 9 3.81,-7.62; 10 6.35,-7.62; 11 8.89,-7.62; 12 11.43,-7.62; 13 13.97,-7.62; 14 16.51,-7.62; 15 16.51,7.62; 16 13.97,7.62; 17 11.43,7.62; 18 8.89,7.62; 19 6.35,7.62; 20 3.81,7.62; 21 1.27,7.62; 22 -1.27,7.62; 23 -3.81,7.62; 24 -6.35,7.62; 25 -8.89,7.62; 26 -11.43,7.62; 27 -13.97,7.62; 28 -16.51,7.62
DIL08 = drill 0.813 long: 1 -3.81,-3.81; 2 -1.27,-3.81; 3 1.27,-3.81; 4 3.81,-3.81; 5 3.81,3.81; 6 1.27,3.81; 7 -1.27,3.81; 8 -3.81,3.81
0207/10 = drill 0.813 octagon: 1 -5.08,0; 2 5.08,0
MA08-2 = drill 1.016 octagon: 1 -8.89,-1.27; 2 -8.89,1.27; 3 -6.35,-1.27; 4 -6.35,1.27; 5 -3.81,-1.27; 6 -3.81,1.27; 7 -1.27,-1.27; 8 -1.27,1.27; 9 1.27,-1.27; 10 1.27,1.27; 11 3.81,-1.27; 12 3.81,1.27; 13 6.35,-1.27; 14 6.35,1.27; 15 8.89,-1.27; 16 8.89,1.27
OMNIBUS = hole 3.175: 208.915,209.55; 259.715,209.55; 189.865,209.55; 139.065,209.55; 75.616,209.55; 126.416,209.55; 56.566,209.55; 5.766,209.55
EDGE-CON8 = smd 2.032 x 13.106: AA1 261.303,7.938; AB1 258.127,7.938; AC1 254.952,7.938; AD1 251.778,7.938; AE1 248.602,7.938; AF1 245.428,7.938; AH1 242.252,7.938; AJ1 239.077,7.938; AK1 235.903,7.938; AL1 232.727,7.938; AM1 229.553,7.938; AN1 226.377,7.938; AP1 223.202,7.938; AR1 220.028,7.938; AS1 216.852,7.938; AT1 213.678,7.938; AU1 210.502,7.938; AV1 207.327,7.938; BA1 191.452,7.938; BB1 188.278,7.938; BC1 185.102,7.938; BD1 181.928,7.938; BE1 178.752,7.938; BF1 175.577,7.938; BH1 172.403,7.938; BJ1 169.227,7.938; BK1 166.053,7.938; BL1 162.877,7.938; BM1 159.702,7.938; BN1 156.528,7.938; BP1 153.352,7.938; BR1 150.178,7.938; BS1 147.002,7.938; BT1 143.827,7.938; BU1 140.653,7.938; BV1 137.477,7.938; CA1 127.953,7.938; CB1 124.778,7.938; CC1 121.603,7.938; CD1 118.427,7.938; CE1 115.252,7.938; CF1 112.078,7.938; CH1 108.903,7.938; CJ1 105.728,7.938; CK1 102.552,7.938; CL1 99.377,7.938; CM1 96.203,7.938; CN1 93.028,7.938; CP1 89.853,7.938; CR1 86.677,7.938; CS1 83.502,7.938; CT1 80.328,7.938; CU1 77.153,7.938; CV1 73.978,7.938; DA1 58.102,7.938; DB1 54.928,7.938; DC1 51.752,7.938; DD1 48.578,7.938; DE1 45.403,7.938; DF1 42.227,7.938; DH1 39.053,7.938; DJ1 35.877,7.938; DK1 32.703,7.938; DL1 29.527,7.938; DM1 26.352,7.938; DN1 23.177,7.938; DP1 20.003,7.938; DR1 16.828,7.938; DS1 13.652,7.938; DT1 10.477,7.938; DU1 7.303,7.938; DV1 4.128,7.938 | smd 2.032 x 13.106 bottom: AA2 261.303,7.938; AB2 258.127,7.938; AC2 254.952,7.938; AD2 251.778,7.938; AE2 248.602,7.938; AF2 245.428,7.938; AH2 242.252,7.938; AJ2 239.077,7.938; AK2 235.903,7.938; AL2 232.727,7.938; AM2 229.553,7.938; AN2 226.377,7.938; AP2 223.202,7.938; AR2 220.028,7.938; AS2 216.852,7.938; AT2 213.678,7.938; AU2 210.502,7.938; AV2 207.327,7.938; BA2 191.452,7.938; BB2 188.278,7.938; BC2 185.102,7.938; BD2 181.928,7.938; BE2 178.752,7.938; BF2 175.577,7.938; BH2 172.403,7.938; BJ2 169.227,7.938; BK2 166.053,7.938; BL2 162.877,7.938; BM2 159.702,7.938; BN2 156.528,7.938; BP2 153.352,7.938; BR2 150.178,7.938; BS2 147.002,7.938; BT2 143.827,7.938; BU2 140.653,7.938; BV2 137.477,7.938; CA2 127.953,7.938; CB2 124.778,7.938; CC2 121.603,7.938; CD2 118.427,7.938; CE2 115.252,7.938; CF2 112.078,7.938; CH2 108.903,7.938; CJ2 105.728,7.938; CK2 102.552,7.938; CL2 99.377,7.938; CM2 96.203,7.938; CN2 93.028,7.938; CP2 89.853,7.938; CR2 86.677,7.938; CS2 83.502,7.938; CT2 80.328,7.938; CU2 77.153,7.938; CV2 73.978,7.938; DA2 58.102,7.938; DB2 54.928,7.938; DC2 51.752,7.938; DD2 48.578,7.938; DE2 45.403,7.938; DF2 42.227,7.938; DH2 39.053,7.938; DJ2 35.877,7.938; DK2 32.703,7.938; DL2 29.527,7.938; DM2 26.352,7.938; DN2 23.177,7.938; DP2 20.003,7.938; DR2 16.828,7.938; DS2 13.652,7.938; DT2 10.477,7.938; DU2 7.303,7.938; DV2 4.128,7.938

### Placement (x,y rotation side)
BAT+  86.23,99.06 270 top
C1  255.14,35.56 180 top
C2  255.14,66.04 180 top
C3  239.9,35.56 180 top
C4  224.66,35.56 180 top
C5  224.66,66.04 180 top
C6  209.42,35.56 180 top
C7  209.42,66.04 180 top
C8  194.18,35.56 180 top
C9  176.4,35.56 180 top
C10  176.4,66.04 180 top
C11  161.16,35.56 180 top
C12  161.16,66.04 180 top
C13  145.92,35.56 180 top
C14  145.92,66.04 180 top
C15  119.25,35.56 180 top
C16  86.23,35.56 180 top
C17  59.56,35.56 180 top
C18  59.56,66.04 180 top
C19  44.32,35.56 180 top
C20  26.54,35.56 180 top
C21  26.54,66.04 180 top
C22  250.06,25.4 180 top
C23  181.48,25.4 180 top
C24  117.98,25.4 180 top
C25  46.86,25.4 180 top
C99  48.13,73.66 90 top
E1  255.14,46.99 270 top
E2  255.14,76.2 270 top
E3  239.9,46.99 270 top
E4  224.66,46.99 270 top
E5  224.66,77.47 270 top
E6  209.42,46.99 270 top
E7  209.42,76.2 270 top
E8  194.18,45.72 270 top
E9  176.4,46.99 270 top
E10  176.4,76.2 270 top
E11  161.16,46.99 270 top
E12  161.16,76.2 270 top
E13  145.92,46.99 270 top
E14  145.92,76.2 270 top
E15  119.25,54.61 270 top
E16  86.23,54.61 270 top
E17  59.56,46.99 270 top
E18  59.56,77.47 270 top
E19  44.32,46.99 270 top
E20  26.54,46.99 270 top
E21  26.54,76.2 270 top
GND  86.23,91.44 270 top
IC1  102.74,80.01 270 top
R1  104.01,53.34 90 top
R2  106.55,53.34 90 top
R3  50.67,76.2 270 top
R4  101.47,53.34 90 top
R5  98.93,53.34 90 top
SV2  239.9,74.93 90 top
U$1  -0.13,0 0 top
U$2  -0.13,0 0 top

### Tracks (layer width: path | path; a pad name or v marks a point on that pad's centre or on a via)
!VCC
  Top 0.406: E16.20 105.28,50.8 105.28,52.7 | 105.28,52.7 105.28,77.47 IC1.6 | E15.20 112.9,50.8 112.9,50.16 112.27,49.53 108.46,49.53 105.28,52.7
!WRITEP  (via drill 0.81)
  Top 0.406: E12.13 162.43,78.74 v162.43,71.12
  Bottom 0.406: E16.27 95.76,68.58 97.03,67.31 125.6,67.31 E15.27 128.14,69.85 161.16,69.85 v162.43,71.12
BAT+
  Top 0.406: IC1.2 86.23,93.98 BAT+.1
BD00  (via drill 0.81)
  Top 0.406: E8.12 204.34,48.26 v204.34,49.53
  Bottom 0.406: v204.34,49.53 227.2,49.53 E4.14
BD01
  Bottom 0.406: E8.9 203.71,40.64 204.98,41.91 227.2,41.91 E4.10
BD02
  Bottom 0.406: E8.5 191.64,44.45 215.14,44.45 216.41,43.18 E4.6
BD03
  Bottom 0.406: E8.2 191.64,52.07 219.58,52.07 E4.3
BD04  (via drill 0.81)
  Top 0.406: v162.43,40.64 162.43,69.22 158.62,73.03 158.62,76.83 157.99,77.47 149.73,77.47 E14.12
  Bottom 0.406: v162.43,40.64 E11.10
BD05  (via drill 0.81)
  Top 0.406: v161.16,50.8 159.89,52.07 159.89,67.94 157.99,69.85 152.27,69.85 152.27,73.03 150.37,74.93 148.46,74.93 148.46,72.39 E14.9
  Bottom 0.406: v161.16,50.8 E11.14
BD06  (via drill 0.81)
  Top 0.406: E11.6 151,49.53 v151,72.39
  Bottom 0.406: v151,72.39 143.38,72.39 E14.5
BD07  (via drill 0.81)
  Top 0.406: v137.03,49.53 137.67,50.16 137.67,80.01 138.94,81.28 E14.2
  Bottom 0.406: E11.3 151.64,50.8 150.37,49.53 v137.03,49.53
BD08
  Top 0.406: E20.10 29.08,41.91 29.08,64.14 30.35,65.41 30.35,66.67 29.08,67.94 29.08,77.47 E21.12
BD09
  Top 0.406: E20.14 31.62,52.07 31.62,69.85 E21.9
BD10
  Bottom 0.406: E20.6 21.46,44.45 21.46,73.66 E21.5
BD11
  Top 0.406: E20.3 21.46,52.07 21.46,80.01 E21.2
EMA0  (via drill 0.81)
  Top 0.406: 227.2,87.63 229.11,89.53 261.49,89.53 261.49,53.34 E1.14 | 227.2,87.63 E5.3 | v134.49,74.93 134.49,78.11 144.02,87.63 227.2,87.63
  Bottom 0.406: E16.1 79.88,72.39 110.36,72.39 E15.1 115.44,74.93 v134.49,74.93
EMA0L
  Bottom 0.406: E1.15 260.22,52.07 260.22,27.3 258.95,26.04 258.95,17.14 254.51,17.14 251.97,14.61 251.97,8.26 U$2.AD2
EMA1  (via drill 0.81)
  Top 0.406: E1.6 252.6,44.45 252.6,53.98 251.97,54.61 239.9,54.61 v239.9,82.55 | E15.26 129.41,68.58 v129.41,88.27
  Bottom 0.406: E16.26 95.76,66.04 97.03,64.77 112.9,64.77 114.17,66.04 E15.26 | v239.9,82.55 222.12,82.55 E5.2 216.41,88.27 v129.41,88.27
EMA1L
  Bottom 0.406: E1.7 256.41,35.56 256.41,18.41 252.6,18.41 248.79,14.61 248.79,8.26 U$2.AE2
EMA2  (via drill 0.81)
  Top 0.406: E15.2 127.51,84.45 v127.51,88.27
  Bottom 0.406: E16.2 79.88,69.85 95.76,69.85 97.03,68.58 E15.2 | E3.14 247.52,54.61 251.97,54.61 261.49,64.14 261.49,82.55 254.51,82.55 251.97,85.09 222.12,85.09 E5.1 217.68,89.53 128.78,89.53 v127.51,88.27
EMA2L  (via drill 0.81)
  Top 0.406: E3.15 244.98,52.07 v244.98,17.78
  Bottom 0.406: v244.98,17.78 242.44,15.24 242.44,8.26 U$2.AH2
GND  (via drill 0.81)
  Top 0.762: E7.6 E7.7 205.61,67.31 C7.2 | E7.9 E7.3 | 251.97,56.52 252.6,57.15 C2.2 252.6,67.31 E2.7 | 251.97,56.52 E1.1 | E4.1 222.12,57.15 C5.2 222.12,67.31 E5.8 222.76,70.48 222.76,74.3 E5.5 | U$2.AC1 255.14,8.26 v255.14,15.88 v255.14,19.68 | v245.62,15.88 245.62,8.26 U$2.AF2 | C1.2 252.6,36.83 E1.8 253.87,40.64 253.87,54.61 251.97,56.52 | E3.8 237.36,36.83 C3.2 238.63,34.29 C22.- | v225.93,15.88 225.93,8.26 U$2.AN2 | E14.7 142.11,67.31 C14.2 v143.38,63.5 | E11.1 158.62,57.15 v158.62,63.5 C12.2 158.62,67.31 E12.7 | C4.2 222.12,36.83 E4.8 218.95,40.01 218.95,45.72 E6.12 | E10.7 172.59,66.04 | 172.59,66.04 v172.59,63.5 172.59,59.69 | 172.59,59.69 E9.1 | 172.59,66.04 C10.2 | C9.2 173.86,36.83 E9.8 175.13,40.64 | E8.7 191.64,36.83 C8.2 185.29,29.21 185.29,8.26 U$2.BC1 | 172.59,59.69 175.13,59.69 175.13,40.64 | 175.13,40.64 175.13,8.26 U$2.BF2 | C6.2 206.88,29.84 213.23,23.5 v213.23,15.88 213.23,8.26 U$2.AT2 | E11.8 157.35,36.83 C11.2 156.72,33.66 v156.72,15.88 156.72,8.26 U$2.BN2 | 143.38,19.68 143.38,8.26 U$2.BT2 | 143.38,19.68 143.38,28.57 | 143.38,28.57 C13.2 | E13.12 151.64,43.81 151.64,36.83 143.38,28.57 | C24.- C15.2 116.71,38.1 E15.14 | C24.- 111.63,20.32 111.63,15.24 | 111.63,15.24 111.63,8.26 U$2.CF2 | 120.52,15.24 121.16,14.61 121.16,8.26 U$2.CC2 | 111.63,15.24 120.52,15.24 | 143.38,19.68 130.68,19.68 130.68,19.05 126.87,15.24 120.52,15.24 | C17.2 51.94,30.48 51.94,19.68 | 51.94,19.68 51.94,8.26 U$2.DC2 | C16.2 83.06,34.92 83.06,32.38 82.42,31.75 80.52,31.75 | 80.52,31.75 78.61,31.75 E16.14 70.99,38.1 E17.12 65.28,47.62 65.28,68.58 | 80.52,31.75 80.52,26.67 | 80.52,26.67 80.52,19.68 | 80.52,19.68 80.52,8.26 U$2.CT2
  Top 0.762: 80.52,26.67 81.79,25.4 | 81.79,25.4 92.58,14.61 92.58,8.26 U$2.CN2 | 80.52,19.68 51.94,19.68 | U$2.DN2 23.37,8.26 23.37,34.92 C20.2 22.73,36.83 E20.8 24.64,38.1 24.64,38.73 25.27,39.37 25.27,53.34 E20.1 24,57.15 C21.2 24,67.31 E21.7 | v10.67,15.88 10.67,8.26 U$2.DT2 | E19.8 40.51,36.83 C19.2 41.78,8.26 U$2.DF2 | 86.23,88.9 IC1.4 | GND.1 86.23,88.9 | 86.23,88.9 65.91,68.58 65.28,68.58 | E18.9 65.28,68.58 | 81.79,25.4 C24.-
  Bottom 0.762: E7.6 E7.9 215.77,71.12 E5.5 | E4.1 222.76,57.78 234.19,57.78 E3.1 237.36,55.88 239.27,57.78 249.43,57.78 E1.1 | v255.14,15.88 255.14,8.26 U$2.AC1 | U$2.AF2 245.62,8.26 v245.62,15.88 246.89,17.14 246.89,19.68 | E1.8 C22.- 246.89,25.4 246.89,19.68 | 246.89,19.68 v255.14,19.68 | 213.87,15.88 213.87,16.51 224.03,16.51 225.3,15.24 | 213.87,15.88 213.87,8.26 U$2.AT2 | 225.3,15.24 225.93,14.61 225.93,8.26 U$2.AN2 | 225.3,15.24 v225.93,15.88 | v143.38,63.5 v158.62,63.5 v172.59,63.5 | 204.98,33.66 C6.2 | 193.55,33.66 201.8,33.66 | 201.8,33.66 204.98,33.66 | C8.2 193.55,33.66 | C9.2 175.77,33.66 193.55,33.66 | 216.41,33.66 E4.8 | 204.98,33.66 216.41,33.66 | v213.23,15.88 213.87,15.88 | E3.8 231.65,33.66 216.41,33.66 | 170.05,15.24 C23.- | 174.5,15.24 170.05,15.24 | 174.5,15.24 175.13,14.61 175.13,8.26 U$2.BF2 | 144.02,15.24 144.02,8.26 U$2.BT2 | 170.05,15.24 156.72,15.24 | 156.72,15.24 144.02,15.24 | 156.72,15.24 156.72,8.26 U$2.BN2 | 174.5,15.24 179.58,15.24 | 179.58,15.24 184.66,15.24 184.66,8.26 U$2.BC1 | 156.72,15.24 v156.72,15.88 | 92.58,14.61 91.95,15.24 80.52,15.24 80.52,8.26 U$2.CT2 | 92.58,14.61 92.58,8.26 U$2.CN2 | 111.63,19.68 111.63,25.4 C24.- 103.38,25.4 92.58,14.61 | 111.63,19.68 111.63,15.24 | 111.63,15.24 111.63,8.26 U$2.CF2 | 111.63,15.24 121.16,15.24 121.16,8.26 U$2.CC2 | 144.02,15.24 139.57,19.68 111.63,19.68 | 10.67,15.24 10.67,8.26 U$2.DT2 | 10.67,15.24 v10.67,15.88 | 41.78,25.4 C19.2 | C25.- 41.78,25.4 | 41.78,15.24 41.78,8.26 U$2.DF2 | 41.78,15.24 41.78,25.4 | 41.78,15.24 24,15.24 | 24,15.24 23.37,15.24 | 23.37,15.24 10.67,15.24 | 23.37,15.24 23.37,8.26 U$2.DN2 | 41.78,15.24 51.31,15.24 51.31,8.26 U$2.DC2
  Bottom 0.762: 24,15.24 C20.2 | 40.51,64.14 40.51,66.04 55.75,66.04 | 40.51,64.14 E19.1 | C18.2 55.75,66.04 | 55.75,66.04 E18.8 E18.9 | C21.2 25.91,64.14 40.51,64.14 | 201.8,33.66 201.8,27.94 192.28,27.94 179.58,15.24
LMEM00
  Bottom 0.406: E6.9 214.5,39.37 229.11,39.37 229.74,40.01 229.74,48.26 E4.13
LMEM01  (via drill 0.81)
  Top 0.406: v217.04,44.45 E6.10
  Bottom 0.406: v217.04,44.45 227.2,44.45 E4.11
LMEM02
  Top 0.406: E6.15 E4.5
LMEM03
  Top 0.406: E6.16 E4.4
LMEM04
  Bottom 0.406: E13.9 153.54,41.91 163.7,41.91 E11.11
LMEM05  (via drill 0.81)
  Top 0.406: v159.89,44.45 161.16,45.72 v161.16,48.26
  Bottom 0.406: E13.10 153.54,44.45 v159.89,44.45 | E11.13 v161.16,48.26
LMEM06  (via drill 0.81)
  Top 0.406: E11.5 152.27,50.8 v152.27,53.34
  Bottom 0.406: E13.15 v152.27,53.34
LMEM07  (via drill 0.81)
  Top 0.406: E11.4 154.18,51.44 v154.18,53.34
  Bottom 0.406: v154.18,53.34 151.64,55.88 E13.16
LMEM08
  Bottom 0.406: E20.11 31.62,41.91 42.42,41.91 47.5,36.83 58.93,36.83 60.2,38.1 E17.9
LMEM09  (via drill 0.81)
  Top 0.406: v63.37,32.38 64.64,33.66 64.64,39.37 E17.10
  Bottom 0.406: E20.13 29.08,46.99 29.08,39.37 41.15,39.37 48.13,32.38 v63.37,32.38
LMEM10
  Bottom 0.406: E20.5 29.08,52.07 49.4,52.07 51.94,54.61 62.1,54.61 E17.15
LMEM11
  Bottom 0.406: E20.4 29.08,54.61 50.67,54.61 53.21,57.15 62.1,57.15 E17.16
MA00  (via drill 0.81)
  Top 0.406: E1.10 257.68,41.91 257.68,48.9 258.32,49.53 262.76,49.53 262.76,89.53 261.49,90.81 133.22,90.81 v133.22,58.42
  Bottom 0.406: E16.23 97.03,58.42 98.3,57.15 125.6,57.15 E15.23 v133.22,58.42
MA00L
  Top 0.406: E1.9 253.87,38.1 253.87,16.51 251.97,14.61 251.97,8.26 U$2.AD1
MA01  (via drill 0.81)
  Top 0.406: v131.95,92.08 131.95,58.42 E15.21
  Bottom 0.406: E16.21 94.49,53.34 95.76,52.07 125.6,52.07 E15.21 | E1.3 262.76,62.23 262.76,92.08 v131.95,92.08
MA01L
  Top 0.406: E1.2 248.79,50.8 248.79,8.26 U$2.AE1
MA02  (via drill 0.81)
  Top 0.406: E3.10 237.36,46.99 v237.36,57.78 | E16.24 102.74,69.85 102.74,81.92 105.92,85.09 110.36,85.09 110.36,67.94 111,67.31 125.6,67.31 125.6,62.23 E15.24
  Bottom 0.406: v237.36,57.78 234.19,60.96 E15.24
MA02L
  Top 0.406: E3.9 243.71,15.88 242.44,14.61 242.44,8.26 U$2.AH1
MA03  (via drill 0.81)
  Top 0.406: E3.6 234.82,44.45 234.82,67.94 229.74,73.03 v229.74,87.63 | v130.68,90.81 130.68,67.31 E15.25
  Bottom 0.406: E16.25 95.76,63.5 97.03,62.23 125.6,62.23 E15.25 | v229.74,87.63 226.57,90.81 v130.68,90.81
MA03L
  Top 0.406: E3.7 234.82,39.37 234.82,18.41 238.63,14.61 238.63,8.26 U$2.AJ1
MA04  (via drill 0.81)
  Top 0.406: E15.3 v123.06,54.61
  Bottom 0.406: E16.3 79.88,67.31 95.76,67.31 97.03,66.04 E15.3 | E9.14 178.94,52.07 130.05,52.07 127.51,54.61 v123.06,54.61
MA04L
  Top 0.406: E9.15 181.48,52.07 181.48,8.26 U$2.BD1
MA05  (via drill 0.81)
  Top 0.406: v176.4,62.87 v176.4,44.45
  Bottom 0.406: E16.4 79.88,64.77 95.76,64.77 97.03,63.5 E15.4 112.9,63.5 114.17,64.77 174.5,64.77 v176.4,62.87 | v176.4,44.45 E9.10
MA05L
  Top 0.406: E9.9 180.21,15.88 178.94,14.61 178.94,8.26 U$2.BE1
MA06  (via drill 0.81)
  Top 0.406: v136.4,40.64 128.14,48.9 128.14,51.44 127.51,52.07 112.9,52.07 112.9,59.69 E15.5
  Bottom 0.406: E16.5 79.88,62.23 94.49,62.23 95.76,60.96 E15.5 | E9.6 168.78,39.37 152.91,39.37 150.37,36.83 140.21,36.83 v136.4,40.64
MA06L
  Top 0.406: E9.7 171.32,39.37 171.32,27.3 172.59,26.04 172.59,8.26 U$2.BH1
MA07  (via drill 0.81)
  Top 0.406: E9.3 173.86,52.07 v173.86,58.42
  Bottom 0.406: E16.6 91.95,58.42 93.22,59.69 110.36,59.69 | E15.6 110.36,59.69 | v173.86,58.42 172.59,59.69 110.36,59.69
MA07L
  Top 0.406: E9.2 167.51,48.26 167.51,15.88 168.78,14.61 168.78,8.26 U$2.BJ1
MA08  (via drill 0.81)
  Top 0.406: E16.7 v72.26,49.53
  Bottom 0.406: E19.14 49.4,49.53 v72.26,49.53 | E15.7 97.03,55.88 95.76,57.15 79.88,57.15 E16.7
MA08L
  Top 0.406: E19.15 49.4,52.07 49.4,15.24 48.77,14.61 48.77,8.26 U$2.DD1
MA09  (via drill 0.81)
  Top 0.406: v69.09,41.91 77.34,50.16 77.34,52.07 E16.8
  Bottom 0.406: E19.10 53.85,40.64 55.12,41.91 v69.09,41.91 | E15.8 95.76,53.34 94.49,54.61 81.79,54.61 80.52,53.34 E16.8
MA09L
  Top 0.406: E19.9 48.13,17.14 45.59,14.61 45.59,8.26 U$2.DE1
MA10  (via drill 0.81)
  Top 0.406: E19.6 43.05,45.72 v43.05,55.88
  Bottom 0.406: v43.05,55.88 45.59,58.42 70.99,58.42 77.34,52.07 | E16.9 77.34,52.07 | E15.9 95.76,50.8 94.49,52.07 77.34,52.07
MA10L
  Top 0.406: E19.7 39.24,39.37 39.24,8.26 U$2.DH1
MA11  (via drill 0.81)
  Top 0.406: E19.3 41.78,52.07 v41.78,57.15 | v72.9,59.69 79.88,59.69 79.88,49.53 | E16.10 79.88,49.53 | E15.10 107.82,48.26 107.82,48.9 107.19,49.53 79.88,49.53
  Bottom 0.406: v41.78,57.15 44.32,59.69 v72.9,59.69
MA11L
  Top 0.406: E19.2 37.97,50.8 37.97,16.51 36.07,14.61 36.07,8.26 U$2.DJ1
MD00L
  Top 0.406: E4.15 233.55,48.26 233.55,16.51 235.46,14.61 235.46,8.26 U$2.AK1
MD01L
  Top 0.406: E4.9 232.28,34.29 232.28,8.26 U$2.AL1
MD02L  (via drill 0.81)
  Top 0.406: v225.93,40.64 225.93,17.78 229.11,14.61 229.11,8.26 U$2.AM1
  Bottom 0.406: v225.93,40.64 E4.7
MD03L
  Top 0.406: E4.2 223.39,50.8 223.39,8.26 U$2.AP1
MD04L
  Top 0.406: E11.9 165.61,37.47 165.61,8.26 U$2.BK1
MD05L
  Top 0.406: E11.15 163.7,52.07 163.7,37.47 162.43,36.2 162.43,8.26 U$2.BL1
MD06L
  Top 0.406: E11.7 159.89,38.1 159.89,8.26 U$2.BM1
MD07L
  Top 0.406: E11.2 158.62,52.07 158.62,42.55 157.99,41.91 153.54,41.91 153.54,8.26 U$2.BP1
MD08L  (via drill 0.81)
  Top 0.406: v31.62,16.51 32.26,15.88 32.26,8.26 U$2.DK1
  Bottom 0.406: E20.9 30.35,16.51 v31.62,16.51
MD09L  (via drill 0.81)
  Top 0.406: v32.89,53.34 32.89,19.68 29.72,16.51 29.72,8.26 U$2.DL1
  Bottom 0.406: v32.89,53.34 E20.15
MD10L  (via drill 0.81)
  Top 0.406: v25.91,37.47 25.91,8.26 U$2.DM1
  Bottom 0.406: v25.91,37.47 E20.7
MD11L
  Top 0.406: E20.2 24,52.07 24,40.01 23.37,39.37 20.19,39.37 20.19,8.26 U$2.DP1
MD_DIRL  (via drill 0.81)
  Top 0.406: E7.5 208.15,71.12 v208.15,32.38
  Bottom 0.406: v208.15,32.38 220.22,20.32 229.74,20.32 235.46,14.61 235.46,8.26 U$2.AK2
MEM00  (via drill 0.81)
  Top 0.406: v99.57,32.38 E16.15 | 201.8,33.66 204.34,36.2 204.34,39.37 E6.7 | 201.8,33.66 v200.53,32.38 | E8.11 201.8,41.91 201.8,33.66
  Bottom 0.406: v200.53,32.38 v99.57,32.38
MEM01  (via drill 0.81)
  Top 0.406: E16.13 81.79,37.47 v81.79,33.02 | v195.45,31.11 197.99,33.66 E8.8
  Bottom 0.406: v81.79,33.02 82.42,32.38 97.66,32.38 98.93,31.11 v195.45,31.11 | E6.6 199.9,43.18 198.63,41.91 197.36,41.91 196.72,41.27 196.72,38.1 E8.8
MEM02  (via drill 0.81)
  Top 0.406: E16.12 86.23,35.56 86.23,30.48 86.87,29.84 109.09,29.84 109.09,30.48 v115.44,36.83 | E6.3 199.26,57.15 192.91,57.15 192.91,43.18 E8.6
  Bottom 0.406: v115.44,36.83 138.94,36.83 141.48,34.29 170.69,34.29 175.77,39.37 189.1,39.37 E8.6
MEM03  (via drill 0.81)
  Top 0.406: E16.11 87.5,36.83 v87.5,31.11 | v182.75,29.84 189.1,36.2 189.1,43.81 189.74,44.45 191.64,44.45 191.64,46.99 | E8.3 191.64,46.99 | E6.2 199.26,59.69 191.64,59.69 191.64,46.99
  Bottom 0.406: v87.5,31.11 88.77,29.84 v182.75,29.84
MEM04
  Top 0.406: E15.19 135.76,39.37 137.67,39.37 | 137.67,39.37 142.11,39.37 E13.7 | E14.11 148.46,77.47 148.46,79.38 149.1,80.01 151,80.01 151,84.45 150.37,85.09 143.38,85.09 143.38,80.64 142.75,80.01 138.94,80.01 138.94,49.53 137.03,47.62 137.03,41.91 137.67,41.27 137.67,39.37
MEM05  (via drill 0.81)
  Top 0.406: E14.8 149.73,57.78 147.83,55.88 v147.83,44.45
  Bottom 0.406: E15.18 128.14,44.45 140.84,44.45 E13.6 146.56,43.18 v147.83,44.45
MEM06  (via drill 0.81)
  Top 0.406: v138.3,43.18 139.57,44.45 139.57,48.9 140.84,50.16 | 140.84,50.16 141.48,50.8 E13.3 | E14.6 140.84,69.85 140.84,50.16
  Bottom 0.406: v138.3,43.18 E15.17
MEM07  (via drill 0.81)
  Top 0.406: v139.57,41.91 140.84,43.18 140.84,48.9 141.48,49.53 143.38,49.53 143.38,52.07 E13.2 144.65,55.88 144.65,76.2 E14.3
  Bottom 0.406: E15.16 128.14,41.91 v139.57,41.91
MEM08  (via drill 0.81)
  Top 0.406: E21.11 30.35,75.56 50.67,55.24 50.67,45.72 E17.7 58.29,38.1 58.29,29.84 v59.56,28.57 | E15.15 117.98,38.1 v117.98,28.57
  Bottom 0.406: v59.56,28.57 v117.98,28.57
MEM09  (via drill 0.81)
  Top 0.406: v41.78,68.58 53.21,57.15 53.21,45.72 E17.6
  Bottom 0.406: v41.78,68.58 E21.8 | E15.13 110.36,39.37 47.5,39.37 46.86,40.01 46.86,41.91 53.85,41.91 55.12,43.18 E17.6
MEM10  (via drill 0.81)
  Top 0.406: v40.51,67.31 51.94,55.88 v51.94,52.7 | v57.02,44.45 57.02,49.53 E17.3
  Bottom 0.406: E21.6 26.54,67.31 v40.51,67.31 | v51.94,52.7 53.85,50.8 E17.3 | E15.12 110.36,44.45 v57.02,44.45
MEM11  (via drill 0.81)
  Top 0.406: E21.3 29.08,85.09 46.86,85.09 46.86,64.77 54.48,57.15 54.48,54.61 E17.2 58.29,50.8 58.29,39.37 v60.83,36.83
  Bottom 0.406: E15.11 112.9,44.45 112.9,36.83 v60.83,36.83
MINE
  Bottom 0.406: E2.8 257.68,69.85 181.48,69.85 E10.9 175.13,71.12 E10.5
N$1  (via drill 0.81)
  Top 0.406: SV2.2 v232.28,72.39
  Bottom 0.406: E5.7 222.12,72.39 v232.28,72.39
N$18
  Bottom 0.406: SV2.4 E5.9
N$19
  Bottom 0.406: SV2.6 E5.10
N$20
  Bottom 0.406: SV2.8 E5.11
N$21
  Bottom 0.406: SV2.10 E5.12
N$22
  Bottom 0.406: SV2.12 E5.13
N$23
  Bottom 0.406: SV2.14 E5.14
N$24
  Bottom 0.406: SV2.16 E5.15
N$25
  Top 0.406: C99.1 R3.2 E18.7
N$26
  Bottom 0.406: SV2.9 E2.4
N$27
  Bottom 0.406: SV2.11 E2.3
N$28
  Bottom 0.406: SV2.13 E2.2
N$29
  Bottom 0.406: SV2.15 E2.1
N$30
  Bottom 0.406: SV2.7 E2.5
N$31
  Top 0.406: E2.11 260.22,77.47 260.22,84.45 259.59,85.09 242.44,85.09 242.44,67.31 SV2.1
N$32
  Bottom 0.406: E2.12 260.22,77.47 260.22,67.31 242.44,67.31 SV2.3
N$33
  Bottom 0.406: SV2.5 E2.6
N$34
  Bottom 0.406: C99.2 50.67,73.66 E18.6
N$35
  Top 0.406: E16.18 101.47,45.72 R4.1
N$36
  Bottom 0.406: E12.4 158.62,77.47 166.88,77.47 168.15,76.2 E10.4
N$37
  Top 0.406: E12.5 E12.6
  Bottom 0.406: 181.48,74.93 182.75,76.2 E7.4 | 181.48,74.93 E10.10 | E12.5 158.62,74.93 181.48,74.93
N$38
  Top 0.406: E16.16 106.55,40.64 R2.1
N$39
  Top 0.406: E10.1 173.86,82.55 205.61,82.55 E7.1
N$40
  Top 0.406: E7.2 E7.10
N$41  (via drill 0.81)
  Top 0.406: E10.3 167.51,73.66 v167.51,50.8
  Bottom 0.406: E6.13 E6.4 199.9,48.26 198.63,49.53 166.24,49.53 | E17.4 E17.13 76.71,48.26 77.98,49.53 133.86,49.53 135.13,48.26 E13.4 E13.13 150.37,48.26 151.64,49.53 166.24,49.53 | 166.24,49.53 v167.51,50.8
N$42
  Bottom 0.406: E18.5 62.1,82.55 62.1,87.63 121.79,87.63 122.43,87 167.51,87 171.96,82.55 178.31,82.55 179.58,81.28 E10.13
N$43
  Top 0.406: E12.12 E12.11
  Bottom 0.406: E10.11 178.94,77.47 168.15,77.47 166.88,78.74 E12.12
N$44
  Top 0.406: E16.17 104.01,43.18 R1.1
N$45
  Top 0.406: R5.1 E16.19
READM
  Top 0.406: E10.8 178.94,69.85 178.94,74.93 E10.2 166.24,74.93 166.24,46.99 E11.12
  Bottom 0.406: E20.12 31.62,46.99 163.7,46.99 | E11.12 163.7,46.99 | E4.12 227.2,46.99 163.7,46.99
ROM_ADDR  (via drill 0.81)
  Top 0.406: v227.2,52.07 224.03,55.24 224.03,75.56 E5.4
  Bottom 0.406: E3.3 230.38,50.8 229.11,52.07 v227.2,52.07
ROM_ADDR_L  (via drill 0.81)
  Top 0.406: v222.76,54.61 224.66,52.7 v224.66,17.78
  Bottom 0.406: E3.2 234.82,54.61 v222.76,54.61 | v224.66,17.78 213.23,17.78 210.69,15.24 210.69,8.26 U$2.AU2
STROBEH  (via drill 0.81)
  Top 0.406: E7.8 209.42,68.58 v209.42,29.21
  Bottom 0.406: v209.42,29.21 219.58,19.05 225.3,19.05 229.11,15.24 229.11,8.26 U$2.AM2
VCC  (via drill 0.81)
  Top 0.762: R5.2 R4.2 R1.2 104.01,81.28 IC1.8 | 61.47,71.75 61.47,66.67 C18.1 61.47,65.41 61.47,38.1 62.1,37.47 C17.1 60.83,34.29 60.83,27.94 C25.+ | E18.11 61.47,71.75 | 61.47,84.45 E18.16 | 61.47,71.75 61.47,84.45 | C20.1 27.81,36.83 v27.81,55.88 27.81,64.77 | C21.1 27.81,64.77 | E21.14 27.81,81.28 27.81,64.77 | 61.47,84.45 57.66,88.27 50.67,88.27 R3.1 | E19.4 E19.5 | E19.13 E19.12 46.23,45.72 | C19.1 46.23,36.2 46.23,41.27 | E19.11 46.23,41.27 | E19.16 46.23,53.98 46.23,45.72 | 46.23,41.27 46.23,45.72 | C15.1 129.41,27.94 C24.+ 129.41,19.68 v128.14,18.41 | 258.32,34.92 261.49,31.75 C22.+ | 258.32,34.92 C1.1 | C7.1 218.95,66.04 218.95,71.75 | E5.6 218.95,71.75 | E7.14 218.95,78.11 218.95,71.75 | E4.16 227.2,57.15 C5.1 226.57,66.67 226.57,84.45 E5.16 | E1.16 257.68,57.15 C2.1 257.05,66.67 257.05,81.92 E2.14 | E1.13 E1.12 E1.11 260.86,41.27 260.86,37.47 258.32,34.92 | E1.4 E1.5 | E3.11 E3.12 E3.13 | C3.1 238,40.01 238,43.81 E3.5 E3.4 | E11.16 163.7,57.15 C12.1 | 146.56,50.16 E13.5 | 146.56,50.16 146.56,64.14 147.19,64.77 | C14.1 147.19,64.77 | E14.14 147.19,81.28 147.19,64.77 | E10.14 174.5,83.82 172.59,85.72 164.97,85.72 E12.14 | C13.1 146.56,37.47 146.56,50.16 | C9.1 178.31,36.2 178.31,41.27 E9.11 E9.12 E9.13 178.31,50.16 178.31,53.98 E9.16 178.94,57.15 C10.1 | E9.4 E9.5 | 195.45,34.29 192.91,31.75 C23.+ | 195.45,34.29 C8.1 | E6.5 203.07,43.18 v203.07,36.83 | E8.14 195.45,50.8 195.45,34.29
  Bottom 0.762: R1.2 R2.2 | v27.81,55.88 E20.16 | R3.1 48.13,83.82 E21.14 | E18.16 104.01,86.36 IC1.8 108.46,85.72 151.64,85.72 | E17.5 E19.12 E19.5 | 86.87,33.66 C16.1 | 86.87,33.66 83.06,33.66 81.15,35.56 C17.1 60.2,33.66 48.77,33.66 C19.1 | C15.1 119.89,33.66 86.87,33.66 | v128.14,18.41 128.14,8.26 U$2.CA2 | C22.+ 261.49,8.26 U$2.AA2 | C7.1 213.87,64.14 225.3,64.14 C5.1 | E3.12 E1.5 | E1.13 E1.4 E1.16 | C4.1 227.84,36.2 228.47,36.2 234.19,41.91 234.19,45.72 E3.5 | E3.4 239.9,52.07 | 239.9,52.07 E3.16 | 239.9,52.07 E3.13 | E5.16 256.41,86.36 E2.14 | C13.1 156.72,35.56 158.62,37.47 161.8,37.47 C11.1 | E12.14 163.07,85.72 151.64,85.72 | E14.14 151.64,85.72 | C14.1 156.72,66.04 158.62,67.94 161.8,67.94 C12.1 164.34,66.67 172.59,66.67 173.86,67.94 177.04,67.94 C10.1 | E9.12 E9.5 | E8.14 195.45,55.88 E9.16 | C6.1 210.06,37.47 206.88,37.47 204.98,35.56 203.07,35.56 | C8.1 203.07,35.56 | 203.07,35.56 v203.07,36.83 | C23.+ 191.64,25.4 191.64,8.26 U$2.BA2 | E7.14 211.33,85.72 182.12,85.72 E10.14
VMEM
  Top 0.406: E16.28 100.2,71.12 100.2,82.55 IC1.1
  Bottom 0.406: E15.28 125.6,69.85 97.03,69.85 95.76,71.12 E16.28
WRITE  (via drill 0.81)
  Top 0.406: v215.14,15.24 214.5,15.88 214.5,34.92 210.69,38.73 v210.69,53.34
  Bottom 0.406: E18.10 77.34,57.15 77.34,54.61 80.52,54.61 81.79,55.88 E16.22 95.76,55.88 97.03,54.61 121.16,54.61 122.43,55.88 E15.22 128.14,57.15 206.88,57.15 v210.69,53.34 | v215.14,15.24 216.41,15.24 216.41,8.26 U$2.AS2
WRITEM
  Top 0.406: E8.10 196.72,44.45 196.72,49.53 E8.13 | E8.4 189.1,46.99 189.1,52.07 E8.1 190.37,68.58 E10.12
  Bottom 0.406: E8.10 192.28,43.18 191.01,41.91 189.74,41.91 189.1,42.55 189.1,45.72 E8.4 | E21.4 25.27,73.66 29.08,73.66 | 29.08,73.66 E21.10 31.62,72.39 78.61,72.39 83.69,77.47 143.38,77.47 | 29.08,82.55 27.81,83.82 E21.1 | 29.08,82.55 E21.13 | 29.08,82.55 29.08,73.66 | E14.13 147.19,83.82 143.38,83.82 | E14.1 143.38,83.82 | E10.6 171.32,72.39 152.91,72.39 151.64,73.66 E14.10 144.65,73.66 E14.4 143.38,76.2 143.38,77.47 | 143.38,77.47 143.38,80.01 | 143.38,80.01 143.38,83.82 | E10.12 178.94,80.01 143.38,80.01